# EAGLE design ALU (EAGLE 5.12)

## Sheet 1 of 5
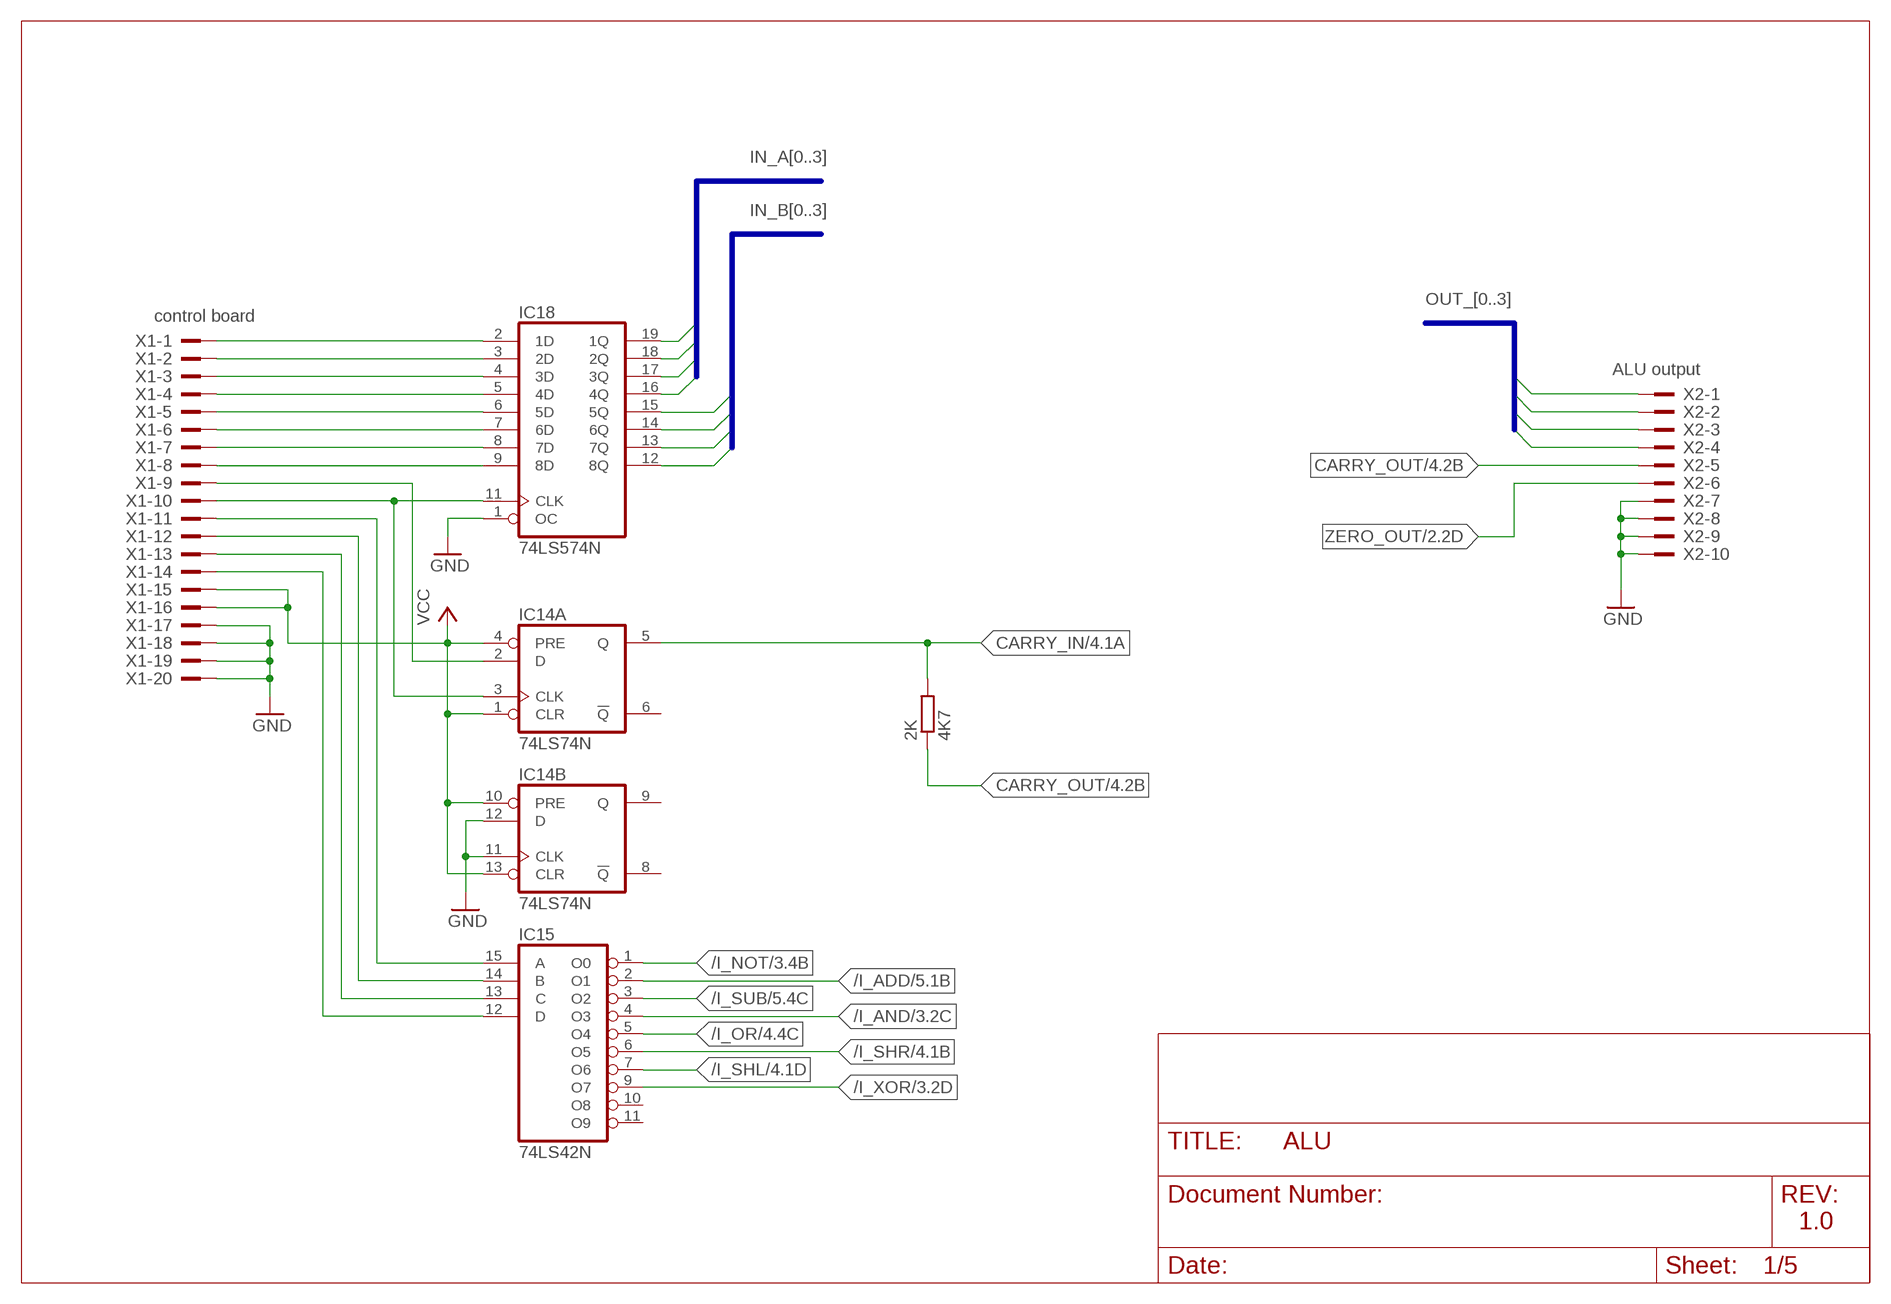
[diagram p0: schematic, sheet 1]

### Parts
2K  4K7  R-EU_0207/12  [0207/12]
IC14  74LS74N  74S74N  [DIL14]
IC15  74LS42N  [DIL16]
IC18  74LS574N  74AS574N  [DIL20]
X1  control board  2520-  [PAK100/2500-20]
X2  ALU output  2510-  [PAK100/2500-10]

### Nets
/I_ADD: IC15.2(O1) ; also sheet 5
/I_AND: IC15.4(O3) ; also sheet 3
/I_NOT: IC15.1(O0) ; also sheet 3
/I_OR: IC15.5(O4) ; also sheet 4
/I_SHL: IC15.7(O6) ; also sheet 4
/I_SHR: IC15.6(O5) ; also sheet 4
/I_SUB: IC15.3(O2) ; also sheet 5
/I_XOR: IC15.9(O7) ; also sheet 3
A0: IC18.2(1D) X1.1
A1: IC18.3(2D) X1.2
A2: IC18.4(3D) X1.3
A3: IC18.5(4D) X1.4
B0: IC18.6(5D) X1.5
B1: IC18.7(6D) X1.6
B2: IC18.8(7D) X1.7
B3: IC18.9(8D) X1.8
CARRY: IC14.2(A:D) X1.9
CARRY_IN: 2K.2 IC14.5(A:Q) ; also sheet 4,5
CARRY_OUT: 2K.1 X2.5 ; also sheet 4,5
FUNC0: IC15.15(A) X1.11
FUNC1: IC15.14(B) X1.12
FUNC2: IC15.13(C) X1.13
FUNC3: IC15.12(D) X1.14
GND: IC14.11(B:CLK) IC14.12(B:D) IC18.1(OC) X1.17 X1.18 X1.19 X1.20 X2.7 X2.8 X2.9 X2.10 ; also sheet 2,3,4,5
IN_A0: IC18.19(1Q) ; also sheet 2,3,4,5
IN_A1: IC18.18(2Q) ; also sheet 2,3,4,5
IN_A2: IC18.17(3Q) ; also sheet 2,3,4,5
IN_A3: IC18.16(4Q) ; also sheet 2,3,4,5
IN_B0: IC18.15(5Q) ; also sheet 2,3,4,5
IN_B1: IC18.14(6Q) ; also sheet 2,3,4,5
IN_B2: IC18.13(7Q) ; also sheet 2,3,4,5
IN_B3: IC18.12(8Q) ; also sheet 2,3,4,5
LOAD_DATA: IC14.3(A:CLK) IC18.11(CLK) X1.10
OUT_0: X2.1 ; also sheet 2,3,4,5
OUT_1: X2.2 ; also sheet 2,3,4,5
OUT_2: X2.3 ; also sheet 2,3,4,5
OUT_3: X2.4 ; also sheet 2,3,4,5
VCC: IC14.1(A:CLR) IC14.4(A:PRE) IC14.10(B:PRE) IC14.13(B:CLR) X1.15 X1.16 ; also sheet 2
ZERO_OUT: X2.6 ; also sheet 2
Unconnected: IC14.6(A:!Q) IC14.8(B:!Q) IC14.9(B:Q) IC15.10(O8) IC15.11(O9)

### Buses
IN_A[0..3]
IN_B[0..3]
OUT_[0..3]

### Notes on the sheet
- 1.0

## Sheet 2 of 5
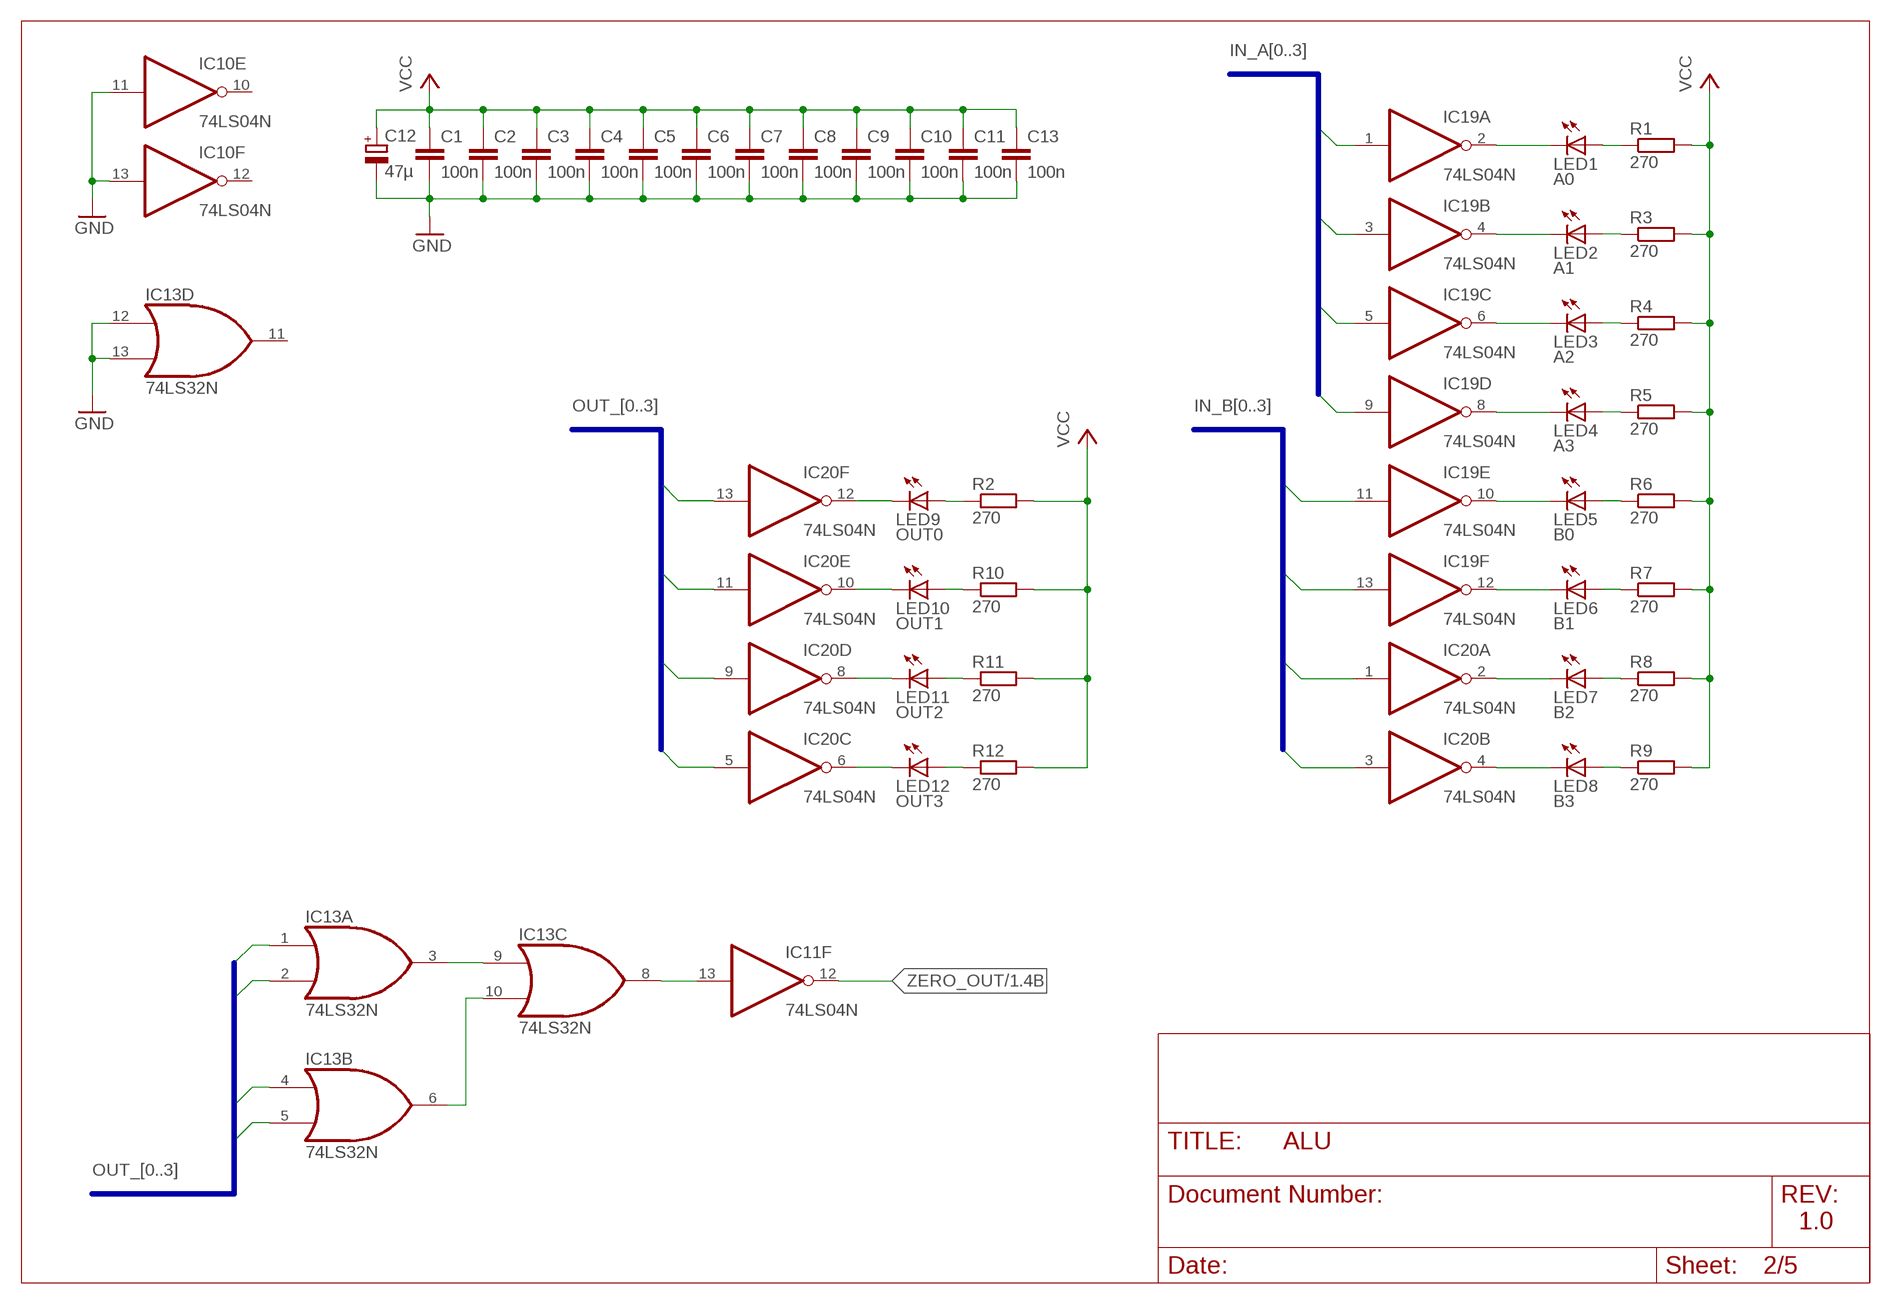
[diagram p1: schematic, sheet 2]

### Parts
C1  100n  C-EU050-025X075  [C050-025X075]
C2  100n  C-EU050-025X075  [C050-025X075]
C3  100n  C-EU050-025X075  [C050-025X075]
C4  100n  C-EU050-025X075  [C050-025X075]
C5  100n  C-EU050-025X075  [C050-025X075]
C6  100n  C-EU050-025X075  [C050-025X075]
C7  100n  C-EU050-025X075  [C050-025X075]
C8  100n  C-EU050-025X075  [C050-025X075]
C9  100n  C-EU050-025X075  [C050-025X075]
C10  100n  C-EU050-025X075  [C050-025X075]
C11  100n  C-EU050-025X075  [C050-025X075]
C12  47µ  CPOL-EUE2.5-6  [E2,5-6]
C13  100n  C-EU050-025X075  [C050-025X075]
IC10  74LS04N  [DIL14]
IC11  74LS04N  [DIL14]
IC13  74LS32N  [DIL14]
IC19  74LS04N  [DIL14]
IC20  74LS04N  [DIL14]
LED1  A0  LED5MM  [LED5MM]
LED2  A1  LED5MM  [LED5MM]
LED3  A2  LED5MM  [LED5MM]
LED4  A3  LED5MM  [LED5MM]
LED5  B0  LED5MM  [LED5MM]
LED6  B1  LED5MM  [LED5MM]
LED7  B2  LED5MM  [LED5MM]
LED8  B3  LED5MM  [LED5MM]
LED9  OUT0  LED5MM  [LED5MM]
LED10  OUT1  LED5MM  [LED5MM]
LED11  OUT2  LED5MM  [LED5MM]
LED12  OUT3  LED5MM  [LED5MM]
R1  270  R-EU_0207/2V  [0207/2V]
R2  270  R-EU_0207/2V  [0207/2V]
R3  270  R-EU_0207/2V  [0207/2V]
R4  270  R-EU_0207/2V  [0207/2V]
R5  270  R-EU_0207/2V  [0207/2V]
R6  270  R-EU_0207/2V  [0207/2V]
R7  270  R-EU_0207/2V  [0207/2V]
R8  270  R-EU_0207/2V  [0207/2V]
R9  270  R-EU_0207/2V  [0207/2V]
R10  270  R-EU_0207/2V  [0207/2V]
R11  270  R-EU_0207/2V  [0207/2V]
R12  270  R-EU_0207/2V  [0207/2V]

### Nets
GND: C1.2 C2.2 C3.2 C4.2 C5.2 C6.2 C7.2 C8.2 C9.2 C10.2 C11.2 C12.- C13.2 IC10.11(E:I) IC10.13(F:I) IC13.12(D:I0) IC13.13(D:I1) ; also sheet 1,3,4,5
IN_A0: IC19.1(A:I) ; also sheet 1,3,4,5
IN_A1: IC19.3(B:I) ; also sheet 1,3,4,5
IN_A2: IC19.5(C:I) ; also sheet 1,3,4,5
IN_A3: IC19.9(D:I) ; also sheet 1,3,4,5
IN_B0: IC19.11(E:I) ; also sheet 1,3,4,5
IN_B1: IC19.13(F:I) ; also sheet 1,3,4,5
IN_B2: IC20.1(A:I) ; also sheet 1,3,4,5
IN_B3: IC20.3(B:I) ; also sheet 1,3,4,5
N$9: IC19.2(A:O) LED1.K(C)
N$12: IC13.3(A:O) IC13.9(C:I0)
N$23: IC19.4(B:O) LED2.K(C)
N$24: IC19.6(C:O) LED3.K(C)
N$25: IC13.6(B:O) IC13.10(C:I1)
N$26: IC11.13(F:I) IC13.8(C:O)
N$27: IC19.8(D:O) LED4.K(C)
N$28: IC19.10(E:O) LED5.K(C)
N$37: IC19.12(F:O) LED6.K(C)
N$38: IC20.2(A:O) LED7.K(C)
N$39: IC20.4(B:O) LED8.K(C)
N$40: LED1.A R1.1
N$41: LED2.A R3.1
N$43: LED3.A R4.1
N$44: LED4.A R5.1
N$45: LED5.A R6.1
N$46: LED6.A R7.1
N$47: LED7.A R8.1
N$48: LED8.A R9.1
N$49: IC20.12(F:O) LED9.K(C)
N$50: IC20.10(E:O) LED10.K(C)
N$51: IC20.8(D:O) LED11.K(C)
N$52: IC20.6(C:O) LED12.K(C)
N$53: LED9.A R2.1
N$54: LED10.A R10.1
N$55: LED11.A R11.1
N$56: LED12.A R12.1
OUT_0: IC13.1(A:I0) IC20.13(F:I) ; also sheet 1,3,4,5
OUT_1: IC13.2(A:I1) IC20.11(E:I) ; also sheet 1,3,4,5
OUT_2: IC13.4(B:I0) IC20.9(D:I) ; also sheet 1,3,4,5
OUT_3: IC13.5(B:I1) IC20.5(C:I) ; also sheet 1,3,4,5
VCC: C1.1 C2.1 C3.1 C4.1 C5.1 C6.1 C7.1 C8.1 C9.1 C10.1 C11.1 C12.+ C13.1 R1.2 R2.2 R3.2 R4.2 R5.2 R6.2 R7.2 R8.2 R9.2 R10.2 R11.2 R12.2 ; also sheet 1
ZERO_OUT: IC11.12(F:O) ; also sheet 1
Unconnected: IC10.10(E:O) IC10.12(F:O) IC13.11(D:O)

### Buses
IN_A[0..3]
IN_B[0..3]
OUT_[0..3]

### Notes on the sheet
- 1.0

## Sheet 3 of 5
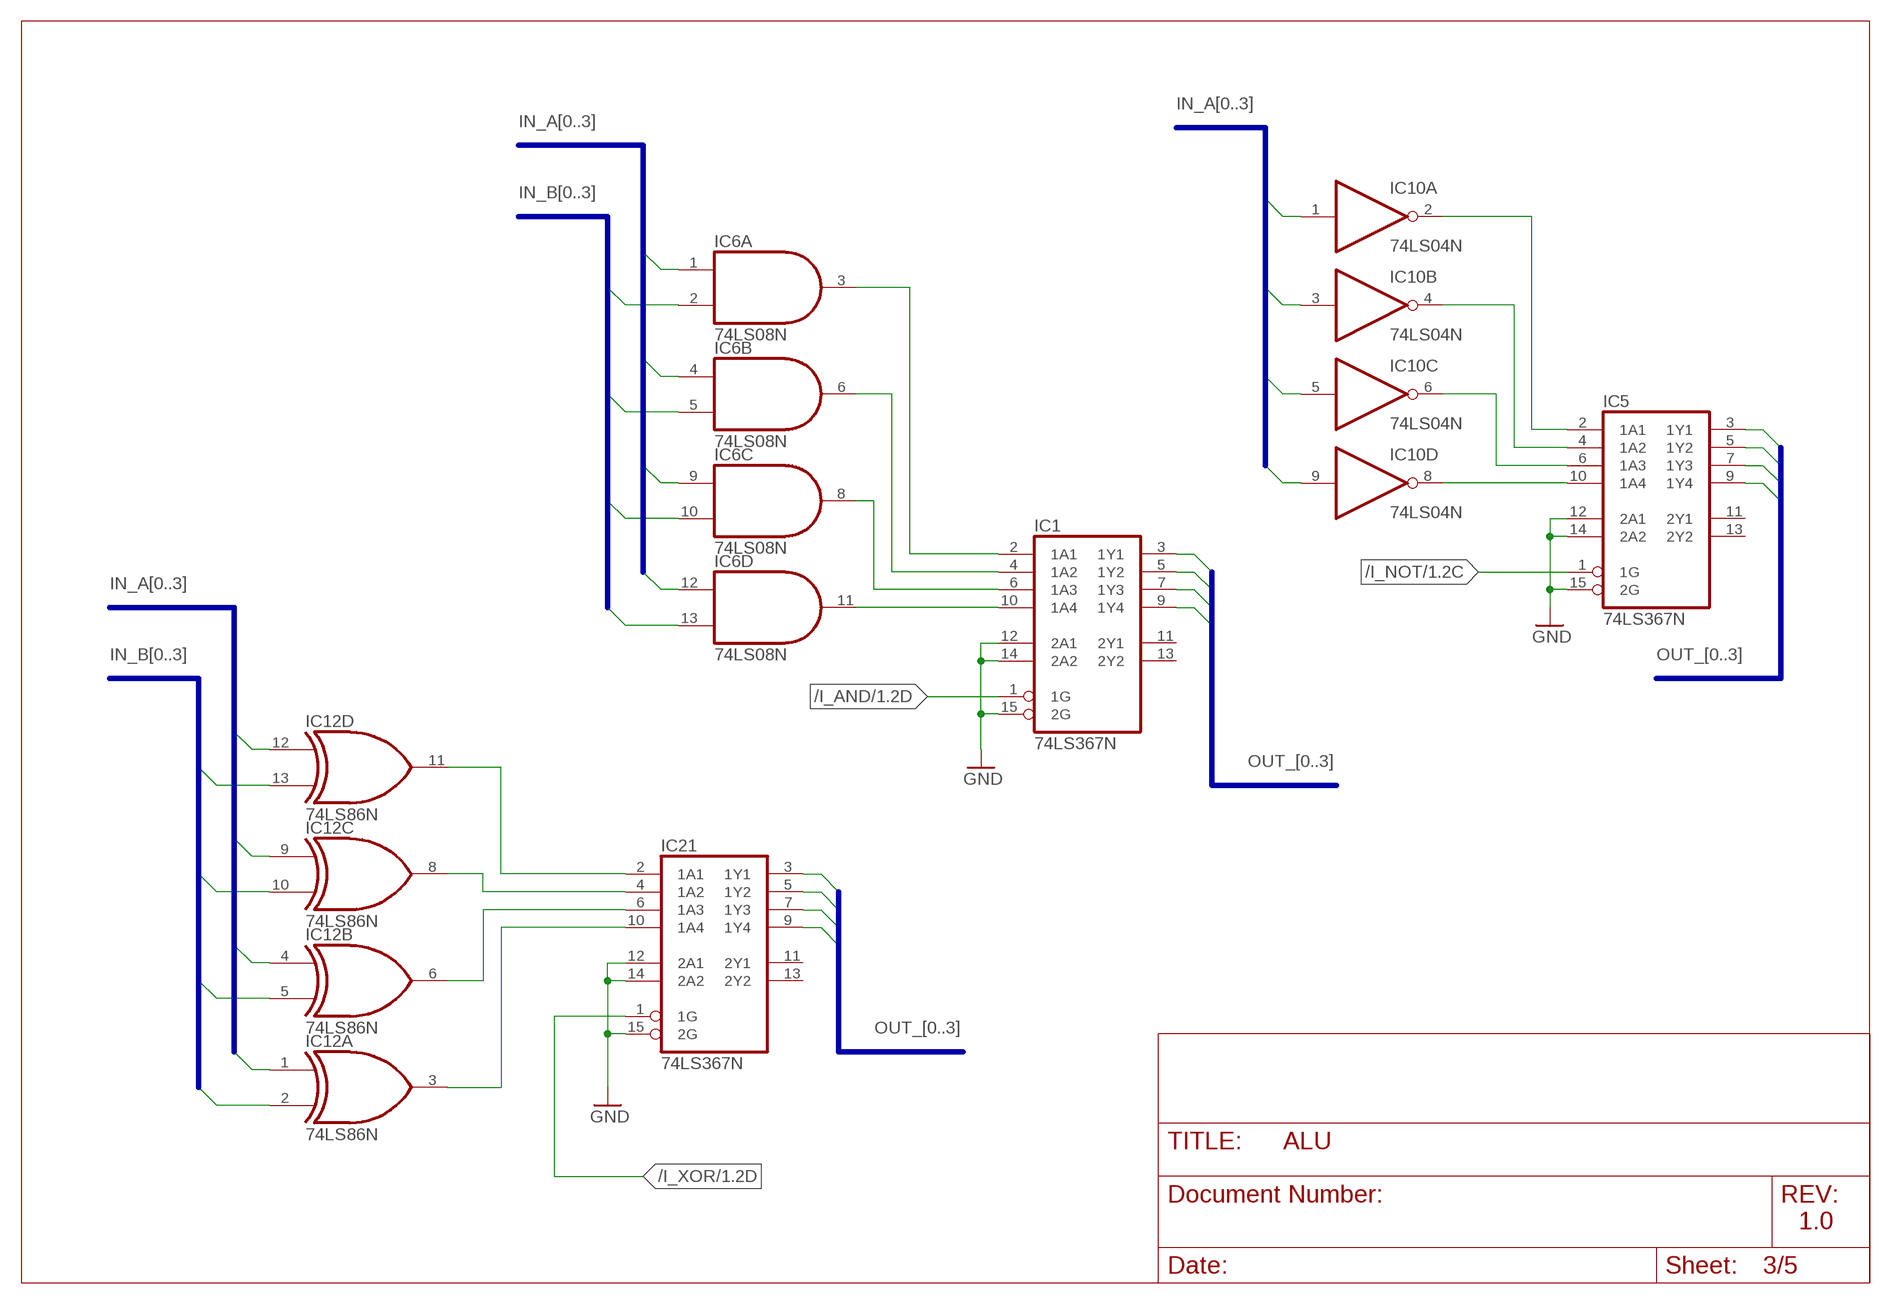
[diagram p2: schematic, sheet 3]

### Parts
IC1  74LS367N  74367N  [DIL16]
IC5  74LS367N  74367N  [DIL16]
IC6  74LS08N  [DIL14]
IC12  74LS86N  [DIL14]
IC21  74LS367N  74367N  [DIL16]

### Nets
/I_AND: IC1.1(1G) ; also sheet 1
/I_NOT: IC5.1(1G) ; also sheet 1
/I_XOR: IC21.1(1G) ; also sheet 1
GND: IC1.12(2A1) IC1.14(2A2) IC1.15(2G) IC5.12(2A1) IC5.14(2A2) IC5.15(2G) IC21.12(2A1) IC21.14(2A2) IC21.15(2G) ; also sheet 1,2,4,5
IN_A0: IC6.1(A:I0) IC10.1(A:I) IC12.12(D:I0) ; also sheet 1,2,4,5
IN_A1: IC6.4(B:I0) IC10.3(B:I) IC12.9(C:I0) ; also sheet 1,2,4,5
IN_A2: IC6.9(C:I0) IC10.5(C:I) IC12.4(B:I0) ; also sheet 1,2,4,5
IN_A3: IC6.12(D:I0) IC10.9(D:I) IC12.1(A:I0) ; also sheet 1,2,4,5
IN_B0: IC6.2(A:I1) IC12.13(D:I1) ; also sheet 1,2,4,5
IN_B1: IC6.5(B:I1) IC12.10(C:I1) ; also sheet 1,2,4,5
IN_B2: IC6.10(C:I1) IC12.5(B:I1) ; also sheet 1,2,4,5
IN_B3: IC6.13(D:I1) IC12.2(A:I1) ; also sheet 1,2,4,5
N$1: IC1.2(1A1) IC6.3(A:O)
N$2: IC1.4(1A2) IC6.6(B:O)
N$3: IC1.6(1A3) IC6.8(C:O)
N$4: IC1.10(1A4) IC6.11(D:O)
N$33: IC5.2(1A1) IC10.2(A:O)
N$34: IC5.4(1A2) IC10.4(B:O)
N$35: IC5.6(1A3) IC10.6(C:O)
N$36: IC5.10(1A4) IC10.8(D:O)
N$63: IC12.11(D:O) IC21.2(1A1)
N$64: IC12.8(C:O) IC21.4(1A2)
N$65: IC12.6(B:O) IC21.6(1A3)
N$66: IC12.3(A:O) IC21.10(1A4)
OUT_0: IC1.3(1Y1) IC5.3(1Y1) IC21.3(1Y1) ; also sheet 1,2,4,5
OUT_1: IC1.5(1Y2) IC5.5(1Y2) IC21.5(1Y2) ; also sheet 1,2,4,5
OUT_2: IC1.7(1Y3) IC5.7(1Y3) IC21.7(1Y3) ; also sheet 1,2,4,5
OUT_3: IC1.9(1Y4) IC5.9(1Y4) IC21.9(1Y4) ; also sheet 1,2,4,5
Unconnected: IC1.11(2Y1) IC1.13(2Y2) IC5.11(2Y1) IC5.13(2Y2) IC21.11(2Y1) IC21.13(2Y2)

### Buses
OUT_[0..3]
IN_A[0..3]
IN_B[0..3]

### Notes on the sheet
- 1.0

## Sheet 4 of 5
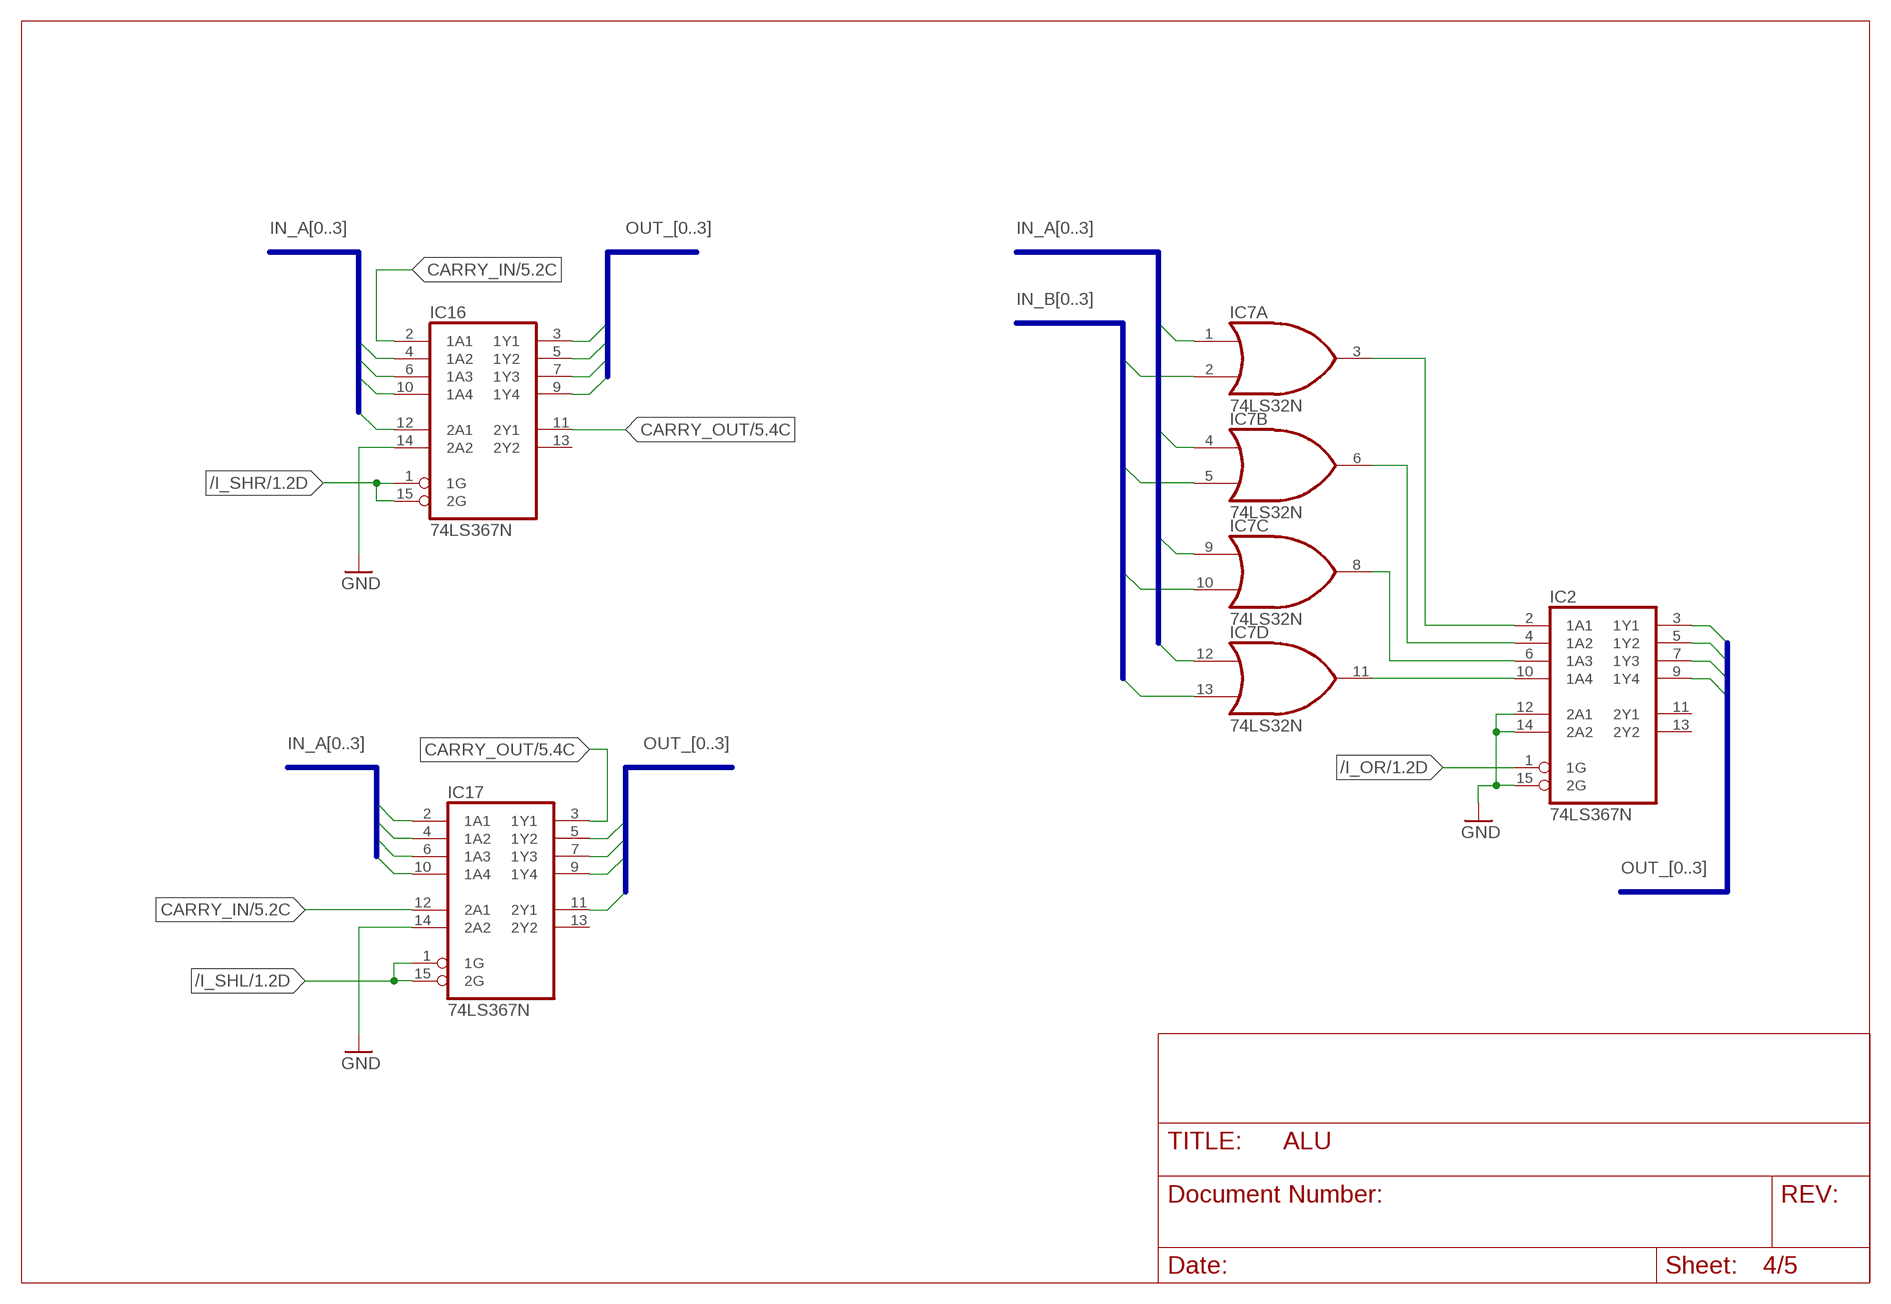
[diagram p3: schematic, sheet 4]

### Parts
IC2  74LS367N  74367N  [DIL16]
IC7  74LS32N  [DIL14]
IC16  74LS367N  74367N  [DIL16]
IC17  74LS367N  74367N  [DIL16]

### Nets
/I_OR: IC2.1(1G) ; also sheet 1
/I_SHL: IC17.1(1G) IC17.15(2G) ; also sheet 1
/I_SHR: IC16.1(1G) IC16.15(2G) ; also sheet 1
CARRY_IN: IC16.2(1A1) IC17.12(2A1) ; also sheet 1,5
CARRY_OUT: IC16.11(2Y1) IC17.3(1Y1) ; also sheet 1,5
GND: IC2.12(2A1) IC2.14(2A2) IC2.15(2G) IC16.14(2A2) IC17.14(2A2) ; also sheet 1,2,3,5
IN_A0: IC7.1(A:I0) IC16.4(1A2) IC17.2(1A1) ; also sheet 1,2,3,5
IN_A1: IC7.4(B:I0) IC16.6(1A3) IC17.4(1A2) ; also sheet 1,2,3,5
IN_A2: IC7.9(C:I0) IC16.10(1A4) IC17.6(1A3) ; also sheet 1,2,3,5
IN_A3: IC7.12(D:I0) IC16.12(2A1) IC17.10(1A4) ; also sheet 1,2,3,5
IN_B0: IC7.2(A:I1) ; also sheet 1,2,3,5
IN_B1: IC7.5(B:I1) ; also sheet 1,2,3,5
IN_B2: IC7.10(C:I1) ; also sheet 1,2,3,5
IN_B3: IC7.13(D:I1) ; also sheet 1,2,3,5
N$5: IC2.10(1A4) IC7.11(D:O)
N$6: IC2.6(1A3) IC7.8(C:O)
N$7: IC2.4(1A2) IC7.6(B:O)
N$8: IC2.2(1A1) IC7.3(A:O)
OUT_0: IC2.3(1Y1) IC16.3(1Y1) IC17.5(1Y2) ; also sheet 1,2,3,5
OUT_1: IC2.5(1Y2) IC16.5(1Y2) IC17.7(1Y3) ; also sheet 1,2,3,5
OUT_2: IC2.7(1Y3) IC16.7(1Y3) IC17.9(1Y4) ; also sheet 1,2,3,5
OUT_3: IC2.9(1Y4) IC16.9(1Y4) IC17.11(2Y1) ; also sheet 1,2,3,5
Unconnected: IC2.11(2Y1) IC2.13(2Y2) IC16.13(2Y2) IC17.13(2Y2)

### Buses
OUT_[0..3]
IN_A[0..3]
IN_B[0..3]

## Sheet 5 of 5
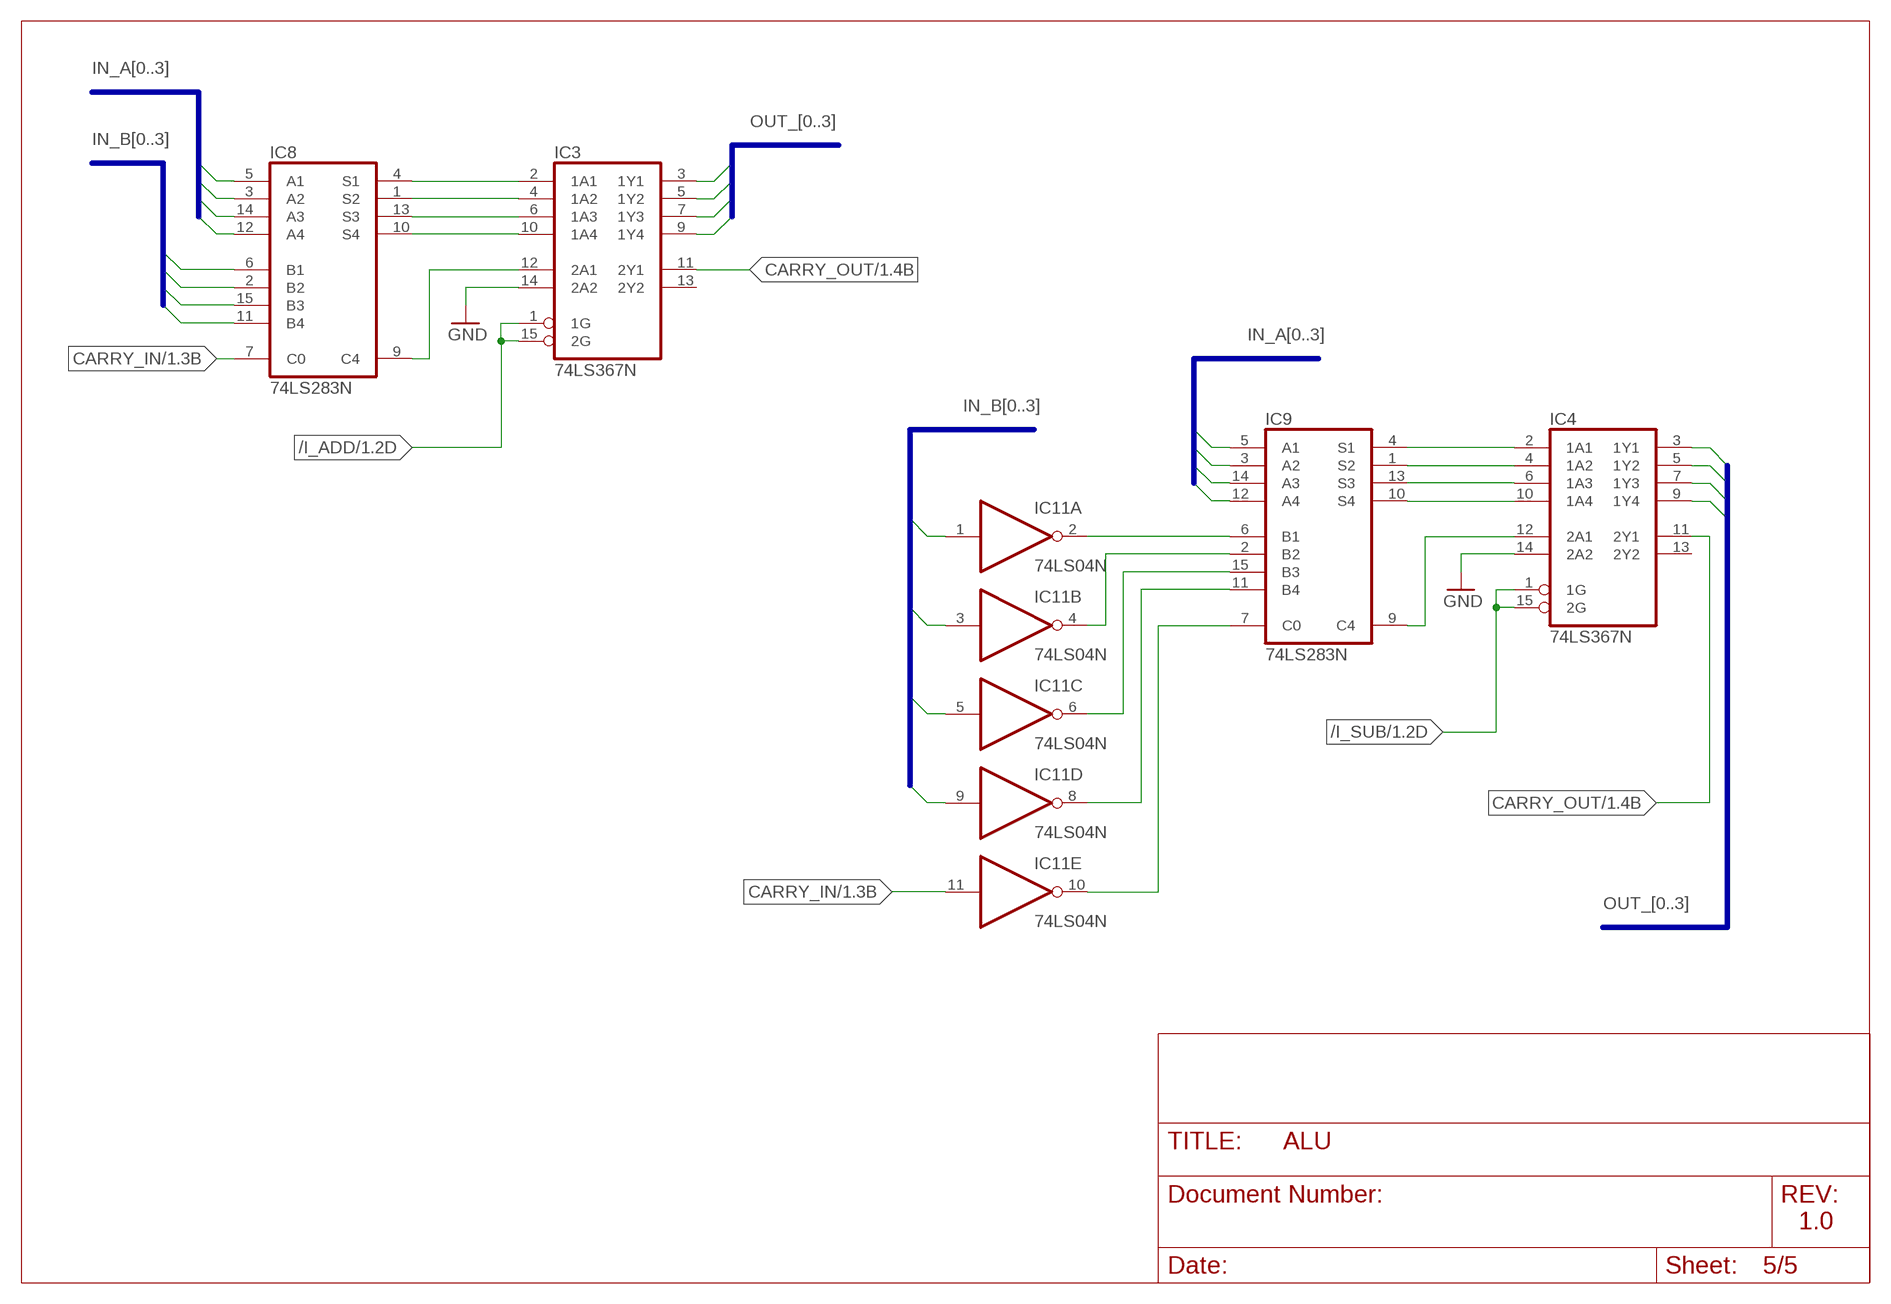
[diagram p4: schematic, sheet 5]

### Parts
IC3  74LS367N  74367N  [DIL16]
IC4  74LS367N  74367N  [DIL16]
IC8  74LS283N  74S283N  [DIL16]
IC9  74LS283N  74S283N  [DIL16]

### Nets
/I_ADD: IC3.1(1G) IC3.15(2G) ; also sheet 1
/I_SUB: IC4.1(1G) IC4.15(2G) ; also sheet 1
CARRY_IN: IC8.7(C0) IC11.11(E:I) ; also sheet 1,4
CARRY_OUT: IC3.11(2Y1) IC4.11(2Y1) ; also sheet 1,4
GND: IC3.14(2A2) IC4.14(2A2) ; also sheet 1,2,3,4
IN_A0: IC8.5(A1) IC9.5(A1) ; also sheet 1,2,3,4
IN_A1: IC8.3(A2) IC9.3(A2) ; also sheet 1,2,3,4
IN_A2: IC8.14(A3) IC9.14(A3) ; also sheet 1,2,3,4
IN_A3: IC8.12(A4) IC9.12(A4) ; also sheet 1,2,3,4
IN_B0: IC8.6(B1) IC11.1(A:I) ; also sheet 1,2,3,4
IN_B1: IC8.2(B2) IC11.3(B:I) ; also sheet 1,2,3,4
IN_B2: IC8.15(B3) IC11.5(C:I) ; also sheet 1,2,3,4
IN_B3: IC8.11(B4) IC11.9(D:I) ; also sheet 1,2,3,4
N$11: IC9.7(C0) IC11.10(E:O)
N$13: IC3.2(1A1) IC8.4(S1)
N$14: IC3.4(1A2) IC8.1(S2)
N$15: IC3.6(1A3) IC8.13(S3)
N$16: IC3.10(1A4) IC8.10(S4)
N$17: IC4.2(1A1) IC9.4(S1)
N$18: IC4.4(1A2) IC9.1(S2)
N$19: IC4.6(1A3) IC9.13(S3)
N$20: IC4.10(1A4) IC9.10(S4)
N$21: IC4.12(2A1) IC9.9(C4)
N$22: IC3.12(2A1) IC8.9(C4)
N$29: IC9.6(B1) IC11.2(A:O)
N$30: IC9.2(B2) IC11.4(B:O)
N$31: IC9.15(B3) IC11.6(C:O)
N$32: IC9.11(B4) IC11.8(D:O)
OUT_0: IC3.3(1Y1) IC4.3(1Y1) ; also sheet 1,2,3,4
OUT_1: IC3.5(1Y2) IC4.5(1Y2) ; also sheet 1,2,3,4
OUT_2: IC3.7(1Y3) IC4.7(1Y3) ; also sheet 1,2,3,4
OUT_3: IC3.9(1Y4) IC4.9(1Y4) ; also sheet 1,2,3,4
Unconnected: IC3.13(2Y2) IC4.13(2Y2)

### Buses
OUT_[0..3]
IN_A[0..3]
IN_B[0..3]

### Notes on the sheet
- 1.0

## Power pins joined to a net without a drawn wire
GND: IC1.8(GND) IC2.8(GND) IC3.8(GND) IC4.8(GND) IC5.8(GND) IC6.7(P:GND) IC7.7(P:GND) IC8.8(GND) IC9.8(GND) IC10.7(P:GND) IC11.7(P:GND) IC12.7(P:GND) IC13.7(P:GND) IC14.7(P:GND) IC15.8(GND) IC16.8(GND) IC17.8(GND) IC18.10(GND) IC19.7(P:GND) IC20.7(P:GND) IC21.8(GND)
VCC: IC1.16(VCC) IC2.16(VCC) IC3.16(VCC) IC4.16(VCC) IC5.16(VCC) IC6.14(P:VCC) IC7.14(P:VCC) IC8.16(VCC) IC9.16(VCC) IC10.14(P:VCC) IC11.14(P:VCC) IC12.14(P:VCC) IC13.14(P:VCC) IC14.14(P:VCC) IC15.16(VCC) IC16.16(VCC) IC17.16(VCC) IC18.20(VCC) IC19.14(P:VCC) IC20.14(P:VCC) IC21.16(VCC)

## Library data of the parts
2K R1-R12 = rcl:R-EU_: RESISTOR, European symbol
C1-C11 C13 = rcl:C-EU: CAPACITOR, European symbol
C12 = rcl:CPOL-EU: POLARIZED CAPACITOR, European symbol
IC1-IC5 IC16 IC17 IC21 = 74xx-us:74*367: Hex BUS DRIVER, 3-state
IC6 = 74xx-us:74*08: Quad 2-input AND gate
IC7 IC13 = 74xx-us:74*32: Quad 2-input OR gate
IC8 IC9 = 74xx-us:74*283: 4-bit binary FULL ADDER, fast carry
IC10 IC11 IC19 IC20 = 74xx-us:74*04: Hex INVERTER
IC12 = 74xx-us:74*86: Quad 2-input EXCLUSIV-OR (XOR) gate
IC14 = 74xx-us:74*74: Dual D type positive edge triggered FLIP FLOP, preset and clear
IC15 = 74xx-us:74*42: 4-line to 10-line DECODER (1-of-10)
IC18 = 74xx-us:74*574: 8-bit D type FLIP FLOP bus driver
LED1-LED12 = led:LED: LED OSRAM: - CHIPLED LG R971, LG N971, LY N971, LG Q971, LY Q971, LO R971, LY R971 LH N974, LH R974 LS Q976, LO Q976, LY Q976 LO Q996 - Hyper CHIPLED LW Q18S LB Q993, LB Q99A, LB R99A - SideLED LS A670, LO A670, LY A670, LG A670, LP A670 LB A673, LV A673, LT A673, LW A673 LH A674 LY A675 LS A676, LA A676, LO A676, LY A676, LW A676 LS A679, LY A679, LG A679 - Hyper Micro SIDELED® LS Y876, LA Y876, LO Y876, LY Y876 LT Y87S - SmartLED LW L88C, LW L88S LB L89C, LB L89S, LG L890 LS L89K, LO L89K, LY L89K LS L896, LA L896, LO L896, LY L896 - TOPLED LS T670, LO T670, LY T670, LG T670, LP T670 LSG T670, LSP T670, LSY T670, LOP T670, LYG T670 LG T671, LOG T671, LSG T671 LB T673, LV T673, LT T673, LW T673 LH T674 LS T676, LA T676, LO T676, LY T676, LB T676, LH T676, LSB T676, LW T676 LB T67C, LV T67C, LT T67C, LS T67K, LO T67K, LY T67K, LW E67C LS E67B, LA E67B, LO E67B, LY E67B, LB E67C, LV E67C, LT E67C LW T67C LS T679, LY T679, LG T679 LS T770, LO T770, LY T770, LG T770, LP T770 LB T773, LV T773, LT T773, LW T773 LH T774 LS E675, LA E675, LY E675, LS T675 LS T776, LA T776, LO T776, LY T776, LB T776 LHGB T686 LT T68C, LB T68C - Hyper Mini TOPLED® LB M676 - Mini TOPLED Santana® LG M470 LS M47K, LO M47K, LY M47K Source: http://www.osram.convergy.de LUXEON: - LUMILED® LXK2-PW12-R00, LXK2-PW12-S00, LXK2-PW14-U00, LXK2-PW14-V00 LXK2-PM12-R00, LXK2-PM12-S00, LXK2-PM14-U00 LXK2-PE12-Q00, LXK2-PE12-R00, LXK2-PE12-S00, LXK2-PE14-T00, LXK2-PE14-U00 LXK2-PB12-K00, LXK2-PB12-L00, LXK2-PB12-M00, LXK2-PB14-N00, LXK2-PB14-P00, LXK2-PB14-Q00 LXK2-PR12-L00, LXK2-PR12-M00, LXK2-PR14-Q00, LXK2-PR14-R00 LXK2-PD12-Q00, LXK2-PD12-R00, LXK2-PD12-S00 LXK2-PH12-R00, LXK2-PH12-S00 LXK2-PL12-P00, LXK2-PL12-Q00, LXK2-PL12-R00 Source: www.luxeon.com KINGBRIGHT: KA-3528ASYC Source: www.kingbright.com
X1 = con-3m:2520-: 3M (TM) Pak 100 4-Wall Header Source: 3M; OC_FARNELL: unknown; OC_NEWARK: unknown
X2 = con-3m:2510-: 3M (TM) Pak 100 4-Wall Header Source: 3M; MF: 3M; MPN: 2510-6002UB; OC_FARNELL: 9838244; OC_NEWARK: 46F4725

## Board
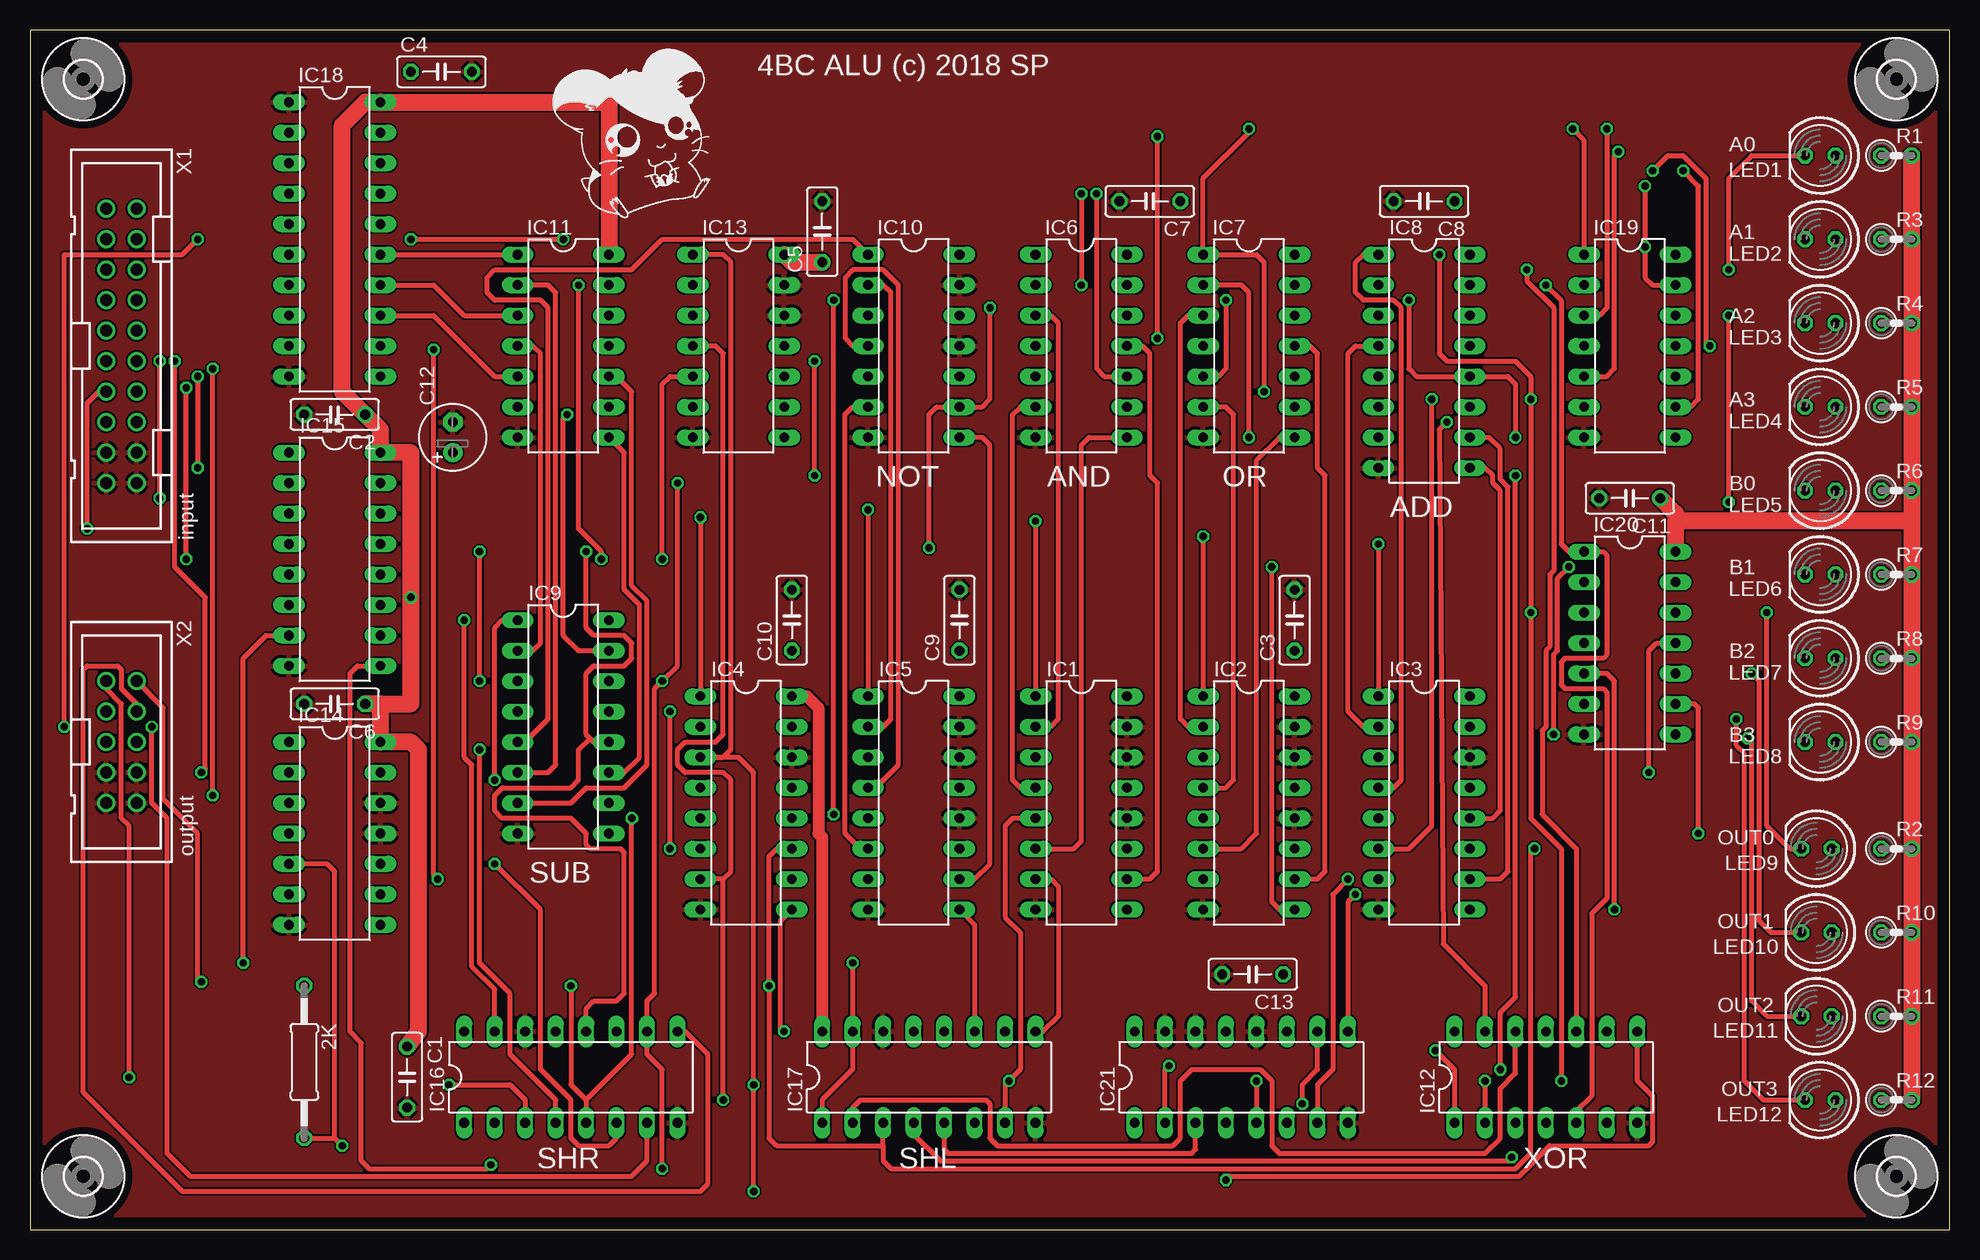
[diagram p5: board, top side]
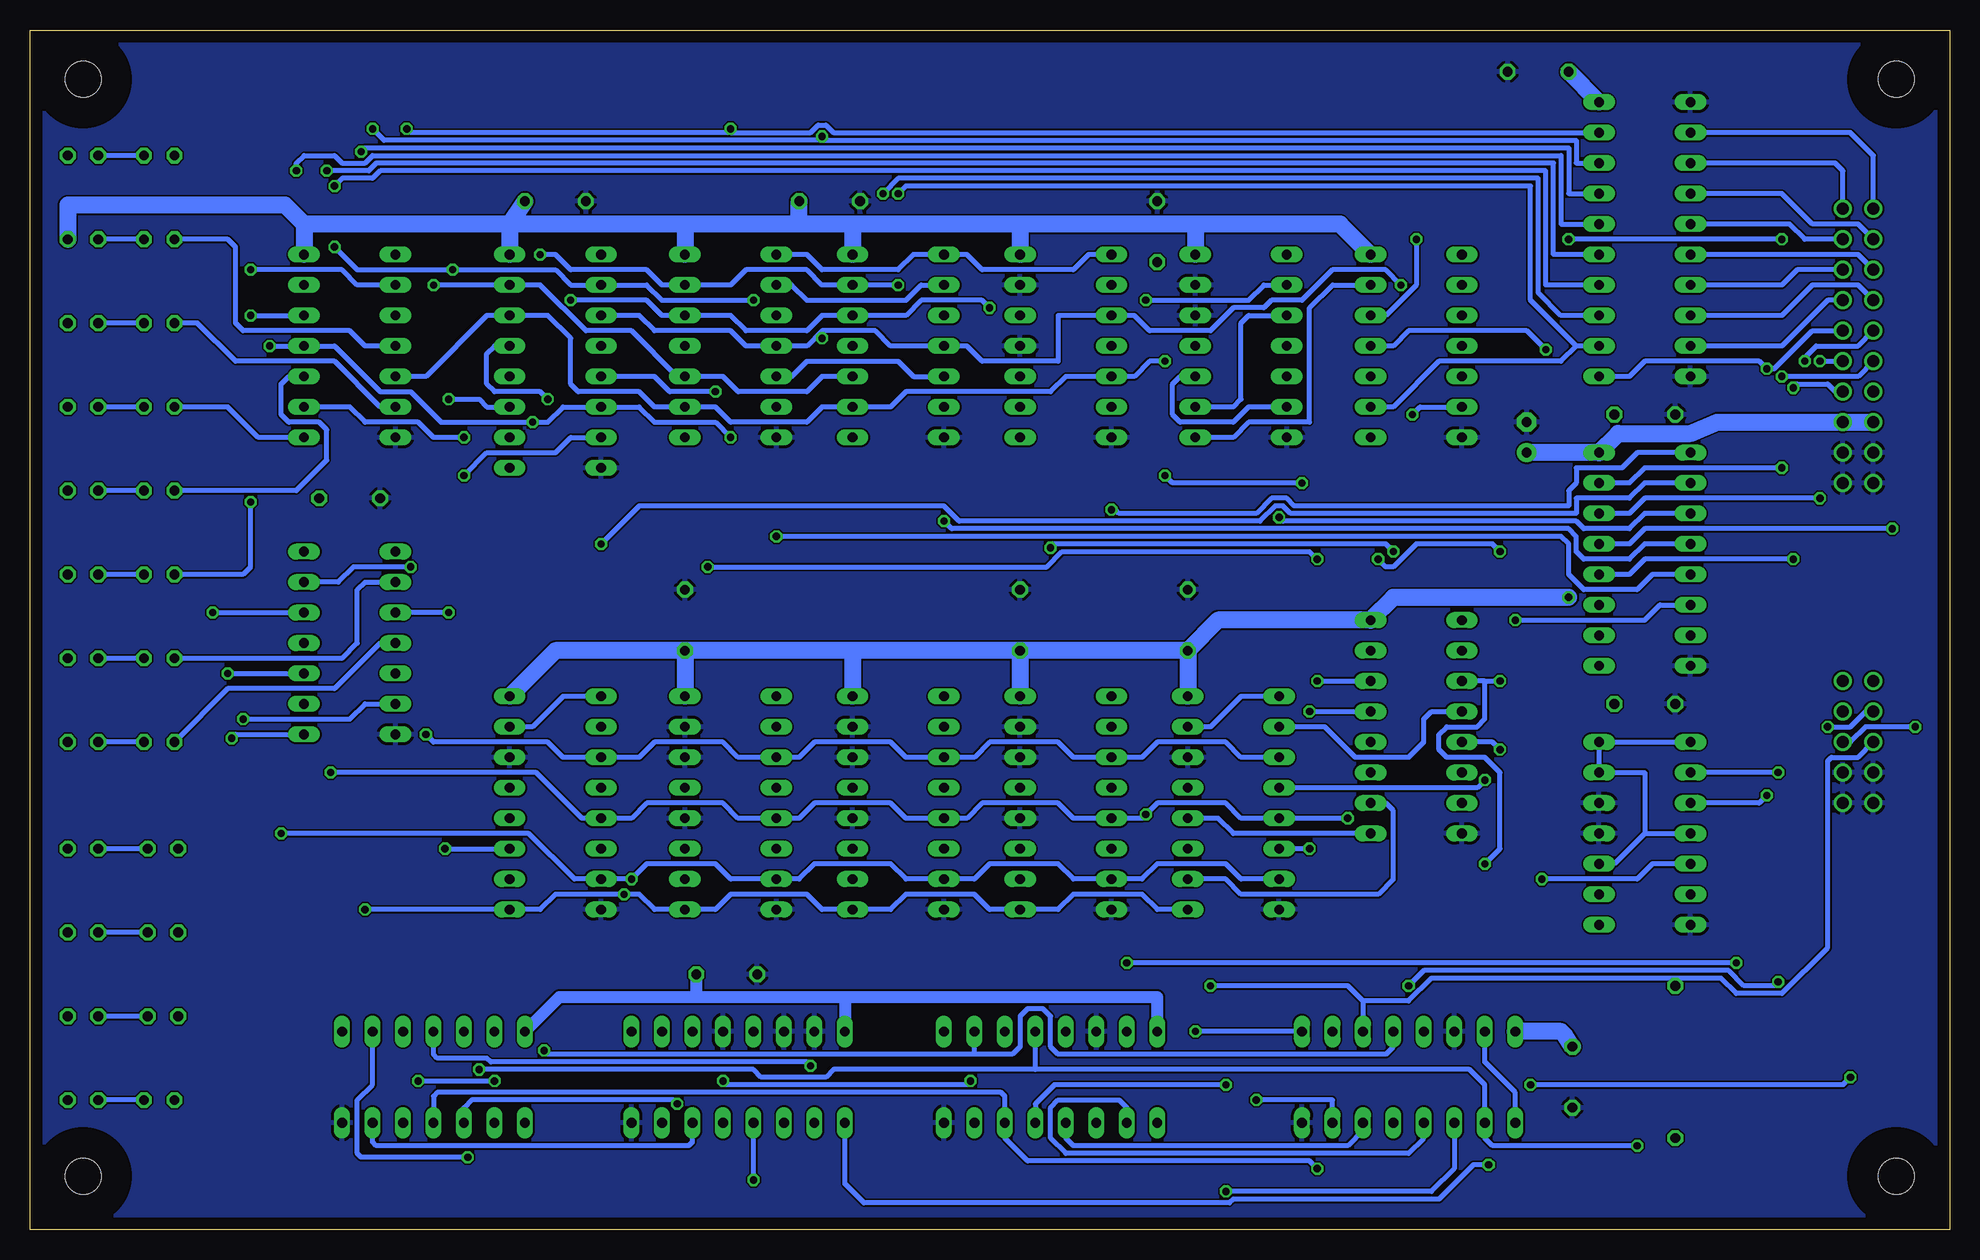
[diagram p6: board, bottom side, seen from below]

Size 160 x 100 mm. Coordinates in mm from the lower left corner, seen from the top.
Outline: 0,0 160,0 160,100 0,100 0,0
Copper layers (1*16): Top 0.035mm / dielectric 1.5mm / Bottom 0.035mm
Design rules "default *": minimum track width 10mil, minimum drill 16mil, track to track 6mil, track to pad 6mil, pad to pad 6mil, via to via 6mil, smd to smd 6mil, copper to edge 40mil, drill to drill 8mil, minimum pad ring 10mil, minimum via ring 8mil, stop-mask expansion 4mil, vias tented up to drill 0mil, thermal gap 10mil

### Footprints (pad centres in the part's own frame; a part is rotated, then mirrored left to right if it is on the bottom)
0207/12 = drill 0.813 octagon: 1 -6.35,0; 2 6.35,0
C050-025X075 = drill 0.813 octagon: 1 -2.54,0; 2 2.54,0
E2,5-6 = drill 0.813 pad 1.6 round: + -1.27,0 | drill 0.813 pad 1.6 octagon: - 1.27,0
DIL16 = drill 0.813 long: 1 -8.89,-3.81; 2 -6.35,-3.81; 3 -3.81,-3.81; 4 -1.27,-3.81; 5 1.27,-3.81; 6 3.81,-3.81; 7 6.35,-3.81; 8 8.89,-3.81; 9 8.89,3.81; 10 6.35,3.81; 11 3.81,3.81; 12 1.27,3.81; 13 -1.27,3.81; 14 -3.81,3.81; 15 -6.35,3.81; 16 -8.89,3.81
DIL14 = drill 0.813 long: 1 -7.62,-3.81; 2 -5.08,-3.81; 3 -2.54,-3.81; 4 0,-3.81; 5 2.54,-3.81; 6 5.08,-3.81; 7 7.62,-3.81; 8 7.62,3.81; 9 5.08,3.81; 10 2.54,3.81; 11 0,3.81; 12 -2.54,3.81; 13 -5.08,3.81; 14 -7.62,3.81
DIL20 = drill 0.813 long: 1 -11.43,-3.81; 2 -8.89,-3.81; 3 -6.35,-3.81; 4 -3.81,-3.81; 5 -1.27,-3.81; 6 1.27,-3.81; 7 3.81,-3.81; 8 6.35,-3.81; 9 8.89,-3.81; 10 11.43,-3.81; 11 11.43,3.81; 12 8.89,3.81; 13 6.35,3.81; 14 3.81,3.81; 15 1.27,3.81; 16 -1.27,3.81; 17 -3.81,3.81; 18 -6.35,3.81; 19 -8.89,3.81; 20 -11.43,3.81
LED5MM = drill 0.813 octagon: A -1.27,0; K 1.27,0
0207/2V = drill 0.813 octagon: 1 -1.27,0; 2 1.27,0
3,0 = hole 3: 0,0
PAK100/2500-20 = drill 1 pad 1.422 round: 1 -11.43,-1.27; 2 -11.43,1.27; 3 -8.89,-1.27; 4 -8.89,1.27; 5 -6.35,-1.27; 6 -6.35,1.27; 7 -3.81,-1.27; 8 -3.81,1.27; 9 -1.27,-1.27; 10 -1.27,1.27; 11 1.27,-1.27; 12 1.27,1.27; 13 3.81,-1.27; 14 3.81,1.27; 15 6.35,-1.27; 16 6.35,1.27; 17 8.89,-1.27; 18 8.89,1.27; 19 11.43,-1.27; 20 11.43,1.27
PAK100/2500-10 = drill 1 pad 1.422 round: 1 -5.08,-1.27; 2 -5.08,1.27; 3 -2.54,-1.27; 4 -2.54,1.27; 5 0,-1.27; 6 0,1.27; 7 2.54,-1.27; 8 2.54,1.27; 9 5.08,-1.27; 10 5.08,1.27

### Placement (x,y rotation side)
2K  22.86,13.97 270 top
C1  31.43,12.7 270 top
C2  25.4,67.94 180 top
C3  105.41,50.8 90 top
C4  34.29,96.52 0 top
C5  66.04,83.19 90 top
C6  25.4,43.81 180 top
C7  93.34,85.72 180 top
C8  116.2,85.72 180 top
C9  77.47,50.8 90 top
C10  63.5,50.8 90 top
C11  133.35,60.96 180 top
C12  35.24,66.04 90 top
C13  101.92,21.27 180 top
IC1  87.63,35.56 270 top
IC2  101.6,35.56 270 top
IC3  116.2,35.56 270 top
IC4  59.69,35.56 270 top
IC5  73.66,35.56 270 top
IC6  87.63,73.66 270 top
IC7  101.6,73.66 270 top
IC8  116.2,72.39 270 top
IC9  44.45,41.91 270 top
IC10  73.66,73.66 270 top
IC11  44.45,73.66 270 top
IC12  126.36,12.7 0 top
IC13  59.05,73.66 270 top
IC14  25.4,33.02 270 top
IC15  25.4,55.88 270 top
IC16  45.09,12.7 0 top
IC17  74.93,12.7 0 top
IC18  25.4,82.55 270 top
IC19  133.35,73.66 270 top
IC20  133.35,48.9 270 top
IC21  100.97,12.7 0 top
LED1  149.22,89.53 180 top
LED2  149.22,82.55 180 top
LED3  149.22,75.56 180 top
LED4  149.22,68.58 180 top
LED5  149.22,61.59 180 top
LED6  149.22,54.61 180 top
LED7  149.22,47.62 180 top
LED8  149.22,40.64 180 top
LED9  148.91,31.75 180 top
LED10  148.91,24.77 180 top
LED11  148.91,17.78 180 top
LED12  149.22,10.79 180 top
R1  155.57,89.53 0 top
R2  155.57,31.75 0 top
R3  155.57,82.55 0 top
R4  155.57,75.56 0 top
R5  155.57,68.58 0 top
R6  155.57,61.59 0 top
R7  155.57,54.61 0 top
R8  155.57,47.62 0 top
R9  155.57,40.64 0 top
R10  155.57,24.77 0 top
R11  155.57,17.78 0 top
R12  155.57,10.79 0 top
U$1  [3,0]  4.45,95.89 0 top
U$2  [3,0]  155.57,95.89 0 top
U$3  [3,0]  155.57,4.45 0 top
U$4  [3,0]  4.45,4.45 0 top
X1  7.62,73.66 270 top
X2  7.62,40.64 270 top

### Tracks (layer width: path | path; a pad name or v marks a point on that pad's centre or on a via)
/I_ADD  (via drill 0.6)
  Top 0.406: v112.39,57.15 IC3.1
  Bottom 0.406: IC3.15 118.11,41.91 115.57,44.45 IC3.1 | v112.39,57.15 109.22,60.33 83.82,60.33 82.55,59.05 57.47,59.05 56.2,60.33 55.56,60.33 54.93,59.69 31.11,59.69 31.11,60.96 26.67,60.96 25.4,62.23 IC15.2
/I_AND  (via drill 0.6)
  Top 0.406: v83.82,59.05 IC1.1
  Bottom 0.406: v83.82,59.05 83.19,58.42 31.75,58.42 31.11,57.78 31.11,56.52 30.48,55.88 26.67,55.88 25.4,57.15 IC15.4
/I_NOT  (via drill 0.6)
  Top 0.406: v69.85,60.01 IC5.1
  Bottom 0.406: v69.85,60.01 69.53,60.01 69.22,59.69 57.78,59.69 56.52,60.96 55.24,60.96 54.61,60.33 31.75,60.33 31.75,61.59 31.11,62.23 31.11,63.5 27.3,63.5 26.04,64.77 IC15.1
/I_OR  (via drill 0.6)
  Top 0.406: v97.79,57.78 IC2.1
  Bottom 0.406: v97.79,57.78 32.38,57.78 31.75,57.15 31.75,54.61 30.48,53.34 26.04,53.34 24.77,54.61 IC15.5
/I_SHL  (via drill 0.6)
  Top 0.406: IC17.1 66.04,10.79 68.58,13.34 IC17.15 v68.58,22.23 | v17.78,22.23 17.78,47.62 19.68,49.53 IC15.7
  Bottom 0.406: v17.78,22.23 v68.58,22.23
/I_SHR  (via drill 0.6)
  Top 0.406: IC16.15 38.73,20 36.83,21.91 36.83,38.73 36.2,39.37 v36.2,50.8
  Bottom 0.406: IC16.1 36.2,11.43 38.73,13.97 IC16.15 | v36.2,50.8 25.4,50.8 24.13,52.07 IC15.6
/I_SUB  (via drill 0.6)
  Top 0.406: v55.88,59.37 IC4.1
  Bottom 0.406: IC4.15 61.59,41.91 59.05,44.45 IC4.1 | v55.88,59.37 55.56,59.05 31.11,59.05 30.48,58.42 26.67,58.42 25.4,59.69 IC15.3
/I_XOR  (via drill 0.6)
  Top 0.406: v38.42,5.4 38.1,5.08 28.26,5.08 27.62,5.71 27.62,15.56 26.67,16.51 26.67,46.35 27.3,46.99 IC15.9
  Bottom 0.406: v38.42,5.4 39.69,5.4 42.55,2.54 59.69,2.54 60.01,2.22 90.49,2.22 92.08,3.81 IC21.1
A0
  Bottom 0.406: X1.1 6.35,89.53 8.26,91.44 IC18.2
A1
  Bottom 0.406: IC18.3 9.53,88.9 8.89,88.27 X1.2
A2
  Bottom 0.406: IC18.4 13.97,86.36 11.43,83.82 7.62,83.82 X1.3
A3
  Bottom 0.406: IC18.5 13.34,83.82 12.06,82.55 X1.4
B0
  Bottom 0.406: IC18.6 7.62,81.28 X1.5
B1
  Bottom 0.406: IC18.7 13.97,78.74 12.7,80.01 X1.6
B2
  Bottom 0.406: IC18.8 13.97,76.2 11.43,78.74 7.62,78.74 X1.7
B3
  Bottom 0.406: IC18.9 13.97,73.66 10.16,77.47 X1.8
CARRY  (via drill 0.6)
  Top 0.406: v14.29,38.1 14.61,38.42 14.61,52.7 12.06,55.24 v12.06,72.39
  Bottom 0.406: v14.29,38.1 IC14.2 | X1.9 7.62,73.66 11.11,73.66 12.06,72.71 v12.06,72.39
CARRY_IN  (via drill 0.6)
  Top 0.406: v123.83,62.87 123.83,19.37 122.56,18.1 v122.56,13.34 | IC14.5 24.77,30.48 25.4,29.84 25.4,7.62 | 25.4,7.62 v26.04,6.99 | v33.97,29.21 33.66,29.53 v33.66,73.34 | 2K.2 25.4,7.62
  Bottom 0.406: IC8.7 114.94,66.04 116.2,64.77 121.92,64.77 v123.83,62.87 | 76.2,13.34 93.03,13.34 93.66,12.7 99.06,12.7 99.69,13.34 v122.56,13.34 | 76.2,13.34 IC17.12 | 76.2,13.34 40.01,13.34 38.73,12.06 IC16.2 38.73,7.62 38.1,6.99 v26.04,6.99 | IC11.11 46.35,73.66 45.09,74.93 35.24,74.93 v33.66,73.34 | v33.97,29.21 26.04,29.21 24.77,30.48 IC14.5
CARRY_OUT  (via drill 0.6)
  Top 0.406: IC4.11 62.23,31.75 61.59,31.11 v61.59,20.32 61.59,7.62 62.23,6.99 71.12,6.99 | v125.41,31.75 125.09,31.43 125.09,6.35 123.83,5.08 71.75,5.08 71.12,5.71 71.12,6.99 | 71.12,6.99 IC17.3
  Bottom 0.406: 48.9,19.05 IC16.11 | 48.9,19.05 50.16,20.32 v61.59,20.32 | v125.41,31.75 IC3.11 | 22.86,20.95 19.05,20.95 17.78,19.68 13.97,19.68 10.16,23.5 10.16,39.05 9.84,39.37 7.62,39.37 X2.5 | 22.86,20.95 43.18,20.95 45.09,19.05 48.9,19.05 | 22.86,20.95 2K.1
FUNC0  (via drill 0.6)
  Top 0.406: v13.97,71.12 v13.97,63.5
  Bottom 0.406: IC15.15 26.67,62.23 25.4,63.5 v13.97,63.5 | X1.11 7.62,71.12 v13.97,71.12
FUNC1  (via drill 0.6)
  Top 0.406: v10.79,60.96 v10.79,72.39
  Bottom 0.406: IC15.14 26.67,59.69 25.4,60.96 v10.79,60.96 | v10.79,72.39 X1.12
FUNC2  (via drill 0.6)
  Top 0.406: v4.76,58.42 4.76,68.9 5.71,69.85 X1.13
  Bottom 0.406: IC15.13 26.67,57.15 25.4,58.42 v4.76,58.42
FUNC3  (via drill 0.6)
  Top 0.406: v13.02,55.88 v13.02,70.17
  Bottom 0.406: IC15.12 26.67,54.61 25.4,55.88 v13.02,55.88 | X1.14 9.53,69.85 10.16,70.48 12.7,70.48 v13.02,70.17
GND
  pour Bottom: 0,100.33 160.02,100.33 160.02,0 0,0
  pour Top: 0,99.69 160.02,99.69 160.02,0 0,0
IN_A0  (via drill 0.6)
  Top 0.406: v102.87,69.85 102.87,80.64 102.23,81.28 IC7.1 97.79,87.63 101.6,91.44 v101.6,91.76 | v37.47,40.01 37.47,22.23 40.01,19.68 40.01,14.61 43.81,10.79 IC16.4 | IC9.5 41.27,40.64 43.18,42.55 43.18,76.83 42.55,77.47 38.73,77.47 38.1,78.11 38.1,79.38 38.73,80.01 50.16,80.01 52.7,82.55 68.58,82.55 IC10.1 | IC19.1 129.54,90.81 v128.59,91.76 | IC17.2 68.58,10.16 69.22,10.79 79.69,10.79 80.01,10.48 80.01,7.62 80.64,6.99 95.25,6.99 95.89,7.62 95.89,12.38 96.84,13.34 102.55,13.34 103.5,12.38 103.5,6.99 104.14,6.35 121.28,6.35 122.56,7.62 122.56,11.75 123.83,13.02 IC12.12
  Bottom 0.406: IC10.1 71.75,81.28 73.03,80.01 80.64,80.01 81.92,81.28 IC6.1 86.36,81.28 87.63,80.01 93.98,80.01 95.25,81.28 IC7.1 | IC8.5 107.95,71.12 106.68,69.85 v102.87,69.85 | IC16.4 43.81,7.62 45.09,6.35 73.66,6.35 74.93,7.62 74.93,10.16 74.3,10.79 69.22,10.79 68.58,10.16 IC17.2 | IC9.5 38.1,40.64 v37.47,40.01 | IC18.19 93.03,91.44 93.66,92.08 94.3,92.08 94.93,91.44 101.6,91.44 | v101.6,91.76 101.6,91.44 | 101.6,91.44 128.27,91.44 v128.59,91.76
IN_A1  (via drill 0.6)
  Top 0.406: IC16.6 48.9,7.62 48.26,6.99 45.72,6.99 45.09,7.62 45.09,10.79 42.55,13.34 42.55,26.67 v38.73,30.48 | v45.72,78.74 45.72,58.42 47.62,56.52 v47.62,55.88 | v37.47,45.72 v37.47,56.52 | v131.44,91.76 131.44,76.83 130.81,76.2 IC19.3 | v93.98,74.3 v93.98,91.12 | IC17.4 73.66,7.94 75.88,5.71 123.19,5.71 v123.51,6.03
  Bottom 0.406: IC18.18 31.11,88.9 31.11,90.81 93.98,90.81 | 93.98,74.93 89.53,74.93 88.27,73.66 IC6.4 81.92,73.66 80.64,72.39 74.3,72.39 74.3,76.2 IC10.3 67.94,76.2 66.67,74.93 61.59,74.93 59.69,76.83 57.15,76.83 56.52,77.47 53.98,77.47 51.44,80.01 46.99,80.01 v45.72,78.74 | 93.98,74.93 95.25,73.66 IC7.4 100.33,73.66 101.6,74.93 107.95,74.93 109.22,76.2 IC8.3 | IC17.4 73.66,7.62 73.03,6.99 50.16,6.99 48.9,8.26 IC16.6 | v38.73,30.48 37.47,31.75 37.47,38.1 38.73,39.37 41.91,39.37 42.55,40.01 42.55,41.27 41.91,41.91 39.37,41.91 38.73,42.55 38.73,45.72 | v47.62,55.88 46.99,55.24 46.35,55.24 44.45,57.15 38.1,57.15 v37.47,56.52 | 38.73,45.72 IC9.3 | 38.73,45.72 v37.47,45.72 | 93.98,90.81 130.49,90.81 v131.44,91.76 | 93.98,74.93 v93.98,74.3 | v93.98,91.12 93.98,90.81 | v123.51,6.03 132.4,6.03 132.72,6.35 132.72,10.79 131.44,12.06 IC12.9
IN_A2  (via drill 0.6)
  Top 0.406: v52.7,5.08 52.7,13.34 51.44,14.61 IC16.10 51.44,19.05 52.07,19.68 52.07,45.09 v52.7,45.72 53.98,46.99 v53.98,62.23 | v65.41,62.87 v65.41,72.39 | v132.4,89.85 132.08,89.53 132.08,71.75 131.44,71.12 IC19.5
  Bottom 0.406: IC18.17 31.75,86.36 31.75,90.17 132.08,90.17 v132.4,89.85 | v52.7,45.72 IC9.14 | v52.7,5.08 53.34,5.71 76.83,5.71 78.74,7.62 IC17.6 78.74,11.11 79.06,11.43 126.05,11.43 126.36,11.11 IC12.4 | v53.98,62.23 64.77,62.23 v65.41,62.87 | v65.41,72.39 66.67,72.39 67.94,71.12 IC10.5 73.66,71.12 74.93,69.85 87,69.85 88.27,68.58 IC6.9 93.98,68.58 95.25,67.31 101.6,67.31 102.87,68.58 IC7.9 107.95,68.58 109.22,69.85 114.3,69.85 114.94,70.48 114.94,74.3 116.84,76.2 IC8.14 121.92,76.2 127,71.12 IC19.5
IN_A3  (via drill 0.6)
  Top 0.406: v114.94,77.47 114.94,71.75 115.57,71.12 IC8.12 123.19,71.12 123.83,70.48 v123.83,66.04 | v80.01,76.83 80.01,69.22 79.38,68.58 IC10.9 75.56,68.58 74.93,67.94 v74.93,56.83 | v46.35,56.52 46.35,50.16 46.99,49.53 49.53,49.53 50.16,48.9 50.16,47.62 49.53,46.99 46.99,46.99 46.35,46.35 46.35,41.27 46.67,40.96 | 46.67,40.96 46.99,40.64 IC9.12 | IC16.12 46.35,18.41 46.99,19.05 48.9,19.05 49.53,19.68 49.53,31.43 49.21,31.75 46.67,31.75 46.35,32.07 46.35,33.02 45.09,34.29 39.37,34.29 38.73,34.92 38.73,36.2 39.37,36.83 45.09,36.83 45.72,37.47 45.72,40.01 46.67,40.96 | v137.79,88.27 139.06,87 139.06,69.22 138.43,68.58 IC19.9 | IC12.1 118.75,13.34 v117.16,14.92
  Bottom 0.406: IC18.16 32.38,83.82 32.38,89.53 131.44,89.53 132.08,88.9 133.99,88.9 134.62,89.53 137.16,89.53 137.79,88.9 v137.79,88.27 | v114.94,77.47 108.58,77.47 107.31,76.2 IC7.12 101.6,76.2 100.33,74.93 95.25,74.93 93.98,76.2 IC6.12 87,76.2 85.72,77.47 80.64,77.47 v80.01,76.83 | 81.28,14.61 IC17.10 | 81.28,14.61 78.11,14.61 77.47,15.24 77.47,17.78 76.83,18.41 75.56,18.41 74.93,17.78 74.93,15.24 74.3,14.61 46.99,14.61 46.35,15.24 IC16.12 | v46.35,56.52 46.99,57.15 74.93,57.15 v74.93,56.83 | IC19.9 133.35,68.58 132.08,67.31 127.64,67.31 126.36,66.04 v123.83,66.04 | v117.16,14.92 116.84,14.61 81.28,14.61
IN_B0  (via drill 0.6)
  Top 0.406: IC18.15 IC11.1 | v101.6,66.04 101.6,78.11 100.97,78.74 IC7.2 | v135.25,88.27 136.53,89.53 137.79,89.53 139.7,87.63 139.7,73.98 v140.02,73.66 | IC12.13 121.28,20.32 117.79,23.81 117.47,66.67 v118.11,67.31
  Bottom 0.406: IC18.15 33.02,81.28 33.02,88.9 131.13,88.9 131.76,88.27 v135.25,88.27 | IC6.2 85.72,78.74 87,77.47 95.25,77.47 96.52,78.74 IC7.2 | v101.6,66.04 102.87,67.31 107.95,67.31 109.22,68.58 IC8.6 115.57,68.58 116.84,67.31 v118.11,67.31 125.73,67.31 128.27,69.85 130.81,69.85 134.62,73.66 IC19.11 v140.02,73.66
IN_B1  (via drill 0.6)
  Top 0.406: IC11.3 36.2,76.2 33.66,78.74 IC18.14 | v99.69,77.47 99.69,71.75 99.06,71.12 IC7.5 | v134.62,87 v134.62,81.92 134.62,79.38 135.25,78.74 IC19.13 | v124.78,80.01 124.78,79.06 127,76.83 127,54.93 126.68,54.61 126.68,48.58 126.36,48.26 126.36,41.91 126.05,41.59 126.05,34.61 128.91,31.75 IC12.10
  Bottom 0.406: IC18.14 33.66,78.74 33.66,88.27 130.81,88.27 131.44,87.63 133.99,87.63 v134.62,87 | IC7.5 96.52,71.12 95.25,72.39 87.63,72.39 86.36,71.12 IC6.5 | v99.69,77.47 107.31,77.47 108.58,78.74 IC8.2 114.94,78.74 116.2,80.01 v124.78,80.01 132.72,80.01 v134.62,81.92
IN_B2  (via drill 0.6)
  Top 0.406: IC11.5 38.73,71.12 33.66,76.2 IC18.13 | v126.36,78.74 127.64,77.47 127.64,57.15 128.27,56.52 IC20.1 131.13,56.52 131.44,56.2 131.44,47.94 131.13,47.62 127.95,47.62 127.64,47.31 127.64,45.4 127.95,45.09 131.13,45.09 131.44,44.77 131.44,27.62 130.18,26.35 130.18,11.11 128.91,9.84 IC12.5 | v88.9,86.36 88.9,71.75 89.53,71.12 IC6.10
  Bottom 0.406: IC18.13 32.38,76.2 34.29,78.11 34.29,87.63 87.63,87.63 v88.9,86.36 | IC6.10 93.98,71.12 95.25,69.85 100.97,69.85 102.23,71.12 IC7.10 106.05,71.12 109.86,74.93 113.67,74.93 117.47,78.74 IC8.15 v126.36,78.74
IN_B3  (via drill 0.6)
  Top 0.406: v87.63,86.36 v87.63,78.74 | v117.47,81.28 117.47,73.03 118.11,72.39 123.83,72.39 125.09,71.12 v125.09,69.22 v125.09,51.44 125.09,34.29 127.64,31.75 v127.64,12.38 | v121.28,12.38 IC12.2
  Bottom 0.406: IC18.12 31.11,73.66 | 31.11,73.66 34.92,77.47 34.92,87 87,87 v87.63,86.36 | IC11.9 46.35,68.58 42.55,72.39 32.38,72.39 31.11,73.66 | v87.63,78.74 IC6.13 93.98,78.74 95.25,80.01 100.33,80.01 101.6,78.74 IC7.13 107.31,78.74 108.58,80.01 114.94,80.01 116.2,81.28 v117.47,81.28 | v125.09,51.44 IC20.3 | v125.09,69.22 122.56,69.22 121.92,68.58 IC8.11 | v127.64,12.38 v121.28,12.38
LOAD_DATA  (via drill 0.6)
  Top 0.406: v15.24,36.2 v15.24,71.75
  Bottom 0.406: IC14.3 15.88,35.56 v15.24,36.2 | X1.10 11.43,74.93 14.61,71.75 v15.24,71.75 15.88,72.39 25.4,72.39 26.67,71.12 IC18.11
N$1
  Top 0.406: IC6.3 85.09,76.2 85.72,75.56 85.72,42.55 85.09,41.91 IC1.2
N$2
  Top 0.406: IC6.6 82.55,68.58 81.92,67.94 81.92,37.47 82.55,36.83 IC1.4
N$3
  Top 0.406: IC6.8 88.27,66.04 87.63,65.41 87.63,32.38 87,31.75 IC1.6
N$4
  Top 0.406: IC1.10 93.34,29.21 93.98,29.84 93.98,62.23 93.34,62.87 93.34,73.03 92.71,73.66 IC6.11
N$5
  Top 0.406: IC7.11 106.68,73.66 107.31,73.03 107.31,63.5 107.95,62.87 107.95,29.84 107.31,29.21 IC2.10
N$6
  Top 0.406: IC7.8 104.14,66.04 102.23,64.14 102.23,33.02 100.97,31.75 IC2.6
N$7
  Top 0.406: IC7.6 99.69,68.58 100.33,67.94 100.33,37.47 99.69,36.83 IC2.4
N$8
  Top 0.406: IC7.3 96.52,76.2 95.89,75.56 95.89,42.55 96.52,41.91 IC2.2
N$9  (via drill 0.6)
  Top 0.406: v141.6,80.01 141.6,87.63 143.51,89.53 LED1.K
  Bottom 0.406: IC19.2 132.72,78.74 133.99,80.01 v141.6,80.01
N$11
  Top 0.406: IC9.7 45.09,35.56 46.35,36.83 49.53,36.83 51.44,38.73 51.44,52.39 50.16,53.66 50.16,69.85 48.9,71.12 IC11.10
N$12
  Bottom 0.406: IC13.3 58.42,76.2 59.05,75.56 59.05,69.22 59.69,68.58 IC13.9
N$13
  Top 0.406: IC3.2 111.12,41.91 109.86,43.18 109.86,73.03 110.49,73.66 IC8.4
N$14
  Top 0.406: IC8.1 111.12,81.28 110.49,80.64 110.49,78.11 111.12,77.47 113.67,77.47 114.3,76.83 114.3,37.47 113.67,36.83 IC3.4
N$15  (via drill 0.6)
  Top 0.406: v116.84,69.22 116.84,33.66 114.94,31.75 IC3.6
  Bottom 0.406: IC8.13 121.28,73.66 121.92,73.03 121.92,70.48 121.28,69.85 117.47,69.85 v116.84,69.22
N$16
  Top 0.406: IC8.10 121.6,66.04 122.56,65.09 122.56,62.55 123.19,61.91 123.19,29.84 122.56,29.21 IC3.10
N$17
  Bottom 0.406: IC4.2 52.7,41.91 52.07,41.91 49.53,39.37 45.09,39.37 43.81,40.64 43.81,42.55 43.18,43.18 IC9.4
N$18  (via drill 0.6)
  Top 0.406: v38.73,37.47 38.73,50.16 39.37,50.8 IC9.1
  Bottom 0.406: IC4.4 39.37,36.83 v38.73,37.47
N$19  (via drill 0.6)
  Top 0.406: v53.34,31.75 v53.34,43.18
  Bottom 0.406: v53.34,31.75 IC4.6 | v53.34,43.18 IC9.13
N$20
  Bottom 0.406: IC4.10 60.33,29.21 59.05,27.94 47.62,27.94 46.35,29.21 46.35,34.92 46.99,35.56 IC9.10
N$21
  Bottom 0.406: IC9.9 59.69,33.02 60.96,34.29 IC4.12
N$22
  Top 0.406: IC3.12 121.92,34.29 122.56,34.92 122.56,61.59 121.92,62.23 121.92,62.87 121.28,63.5 IC8.9
N$23
  Bottom 0.406: LED2.K 143.51,82.55 142.88,81.92 142.88,75.56 142.24,74.93 133.35,74.93 132.08,73.66 IC19.4
N$24
  Bottom 0.406: IC19.6 130.81,68.58 134.62,72.39 142.88,72.39 146.05,75.56 LED3.K
N$25
  Bottom 0.406: IC13.10 64.14,71.12 64.77,70.48 64.77,67.94 64.14,67.31 59.69,67.31 58.42,68.58 IC13.6
N$26
  Bottom 0.406: IC11.13 51.44,78.74 53.34,76.83 53.34,67.31 58.42,67.31 59.69,66.04 IC13.8
N$27
  Bottom 0.406: IC19.8 140.97,66.04 143.51,68.58 LED4.K
N$28
  Bottom 0.406: IC19.10 138.43,71.12 139.06,70.48 139.06,67.94 138.43,67.31 135.89,67.31 135.25,66.67 135.25,64.14 137.79,61.59 LED5.K
N$29
  Top 0.406: IC11.2 43.18,78.74 43.81,78.11 43.81,38.73 43.18,38.1 IC9.6
N$30
  Top 0.406: IC9.2 41.91,48.26 42.55,48.9 42.55,73.03 41.91,73.66 IC11.4
N$31  (via drill 0.6)
  Top 0.406: v44.77,67.94 44.45,67.63 44.45,49.53 45.72,48.26 IC9.15
  Bottom 0.406: IC11.6 44.13,68.58 v44.77,67.94
N$32
  Top 0.406: IC9.11 49.53,38.1 50.8,39.37 50.8,52.07 49.53,53.34 49.53,64.77 IC11.8
N$33
  Top 0.406: IC10.2 71.12,78.74 71.75,78.11 71.75,42.55 71.12,41.91 IC5.2
N$34
  Top 0.406: IC5.4 70.48,36.83 72.39,38.73 72.39,78.74 71.12,80.01 68.58,80.01 67.94,79.38 67.94,74.3 68.58,73.66 IC10.4
N$35
  Top 0.406: IC5.6 69.22,31.75 67.94,33.02 67.94,67.94 68.58,68.58 IC10.6
N$36
  Top 0.406: IC5.10 78.74,29.21 80.01,30.48 80.01,65.41 79.38,66.04 IC10.8
N$37  (via drill 0.6)
  Top 0.406: v141.6,60.64 v141.6,76.2
  Bottom 0.406: v141.6,60.64 141.6,55.24 142.24,54.61 LED6.K | v141.6,76.2 IC19.12
N$38
  Bottom 0.406: LED7.K 133.99,47.62 132.72,48.9 132.72,53.34 132.08,53.98 IC20.2
N$39
  Bottom 0.406: IC20.4 130.81,48.9 134.62,45.09 143.51,45.09 LED8.K
N$40
  Bottom 0.406: LED1.A R1.1
N$41
  Bottom 0.406: LED2.A R3.1
N$43
  Bottom 0.406: LED3.A R4.1
N$44
  Bottom 0.406: LED4.A R5.1
N$45
  Bottom 0.406: LED5.A R6.1
N$46
  Bottom 0.406: LED6.A R7.1
N$47
  Bottom 0.406: LED7.A R8.1
N$48
  Bottom 0.406: LED8.A R9.1
N$49  (via drill 0.6)
  Top 0.406: v144.78,51.44 144.78,33.66 146.69,31.75 LED9.K
  Bottom 0.406: v144.78,51.44 IC20.12
N$50  (via drill 0.6)
  Top 0.406: v143.51,46.35 144.15,45.72 144.15,25.72 145.1,24.77 LED10.K
  Bottom 0.406: v143.51,46.35 IC20.10
N$51  (via drill 0.6)
  Top 0.406: v143.19,40.96 143.51,40.64 143.51,19.05 144.78,17.78 LED11.K
  Bottom 0.406: IC20.8 142.88,41.27 v143.19,40.96
N$52  (via drill 0.6)
  Top 0.406: v142.24,42.55 142.24,40.32 142.88,39.69 142.88,12.38 144.46,10.79 LED12.K
  Bottom 0.406: IC20.6 132.08,43.81 133.35,42.55 v142.24,42.55
N$53
  Bottom 0.406: LED9.A R2.1
N$54
  Bottom 0.406: LED10.A R10.1
N$55
  Bottom 0.406: LED11.A R11.1
N$56
  Bottom 0.406: LED12.A R12.1
N$63  (via drill 0.6)
  Top 0.406: IC21.2 94.61,13.34 v94.93,13.65
  Bottom 0.406: v94.93,13.65 95.25,13.97 121.6,13.97 121.92,14.29 126.05,14.29 126.36,14.61 IC12.11
N$64  (via drill 0.6)
  Top 0.406: IC12.8 133.99,12.38 135.25,11.11 135.25,7.3 134.94,6.99 126.68,6.99 124.14,4.45 100.01,4.45 v99.69,4.13
  Bottom 0.406: v99.69,4.13 IC21.4
N$65
  Bottom 0.406: IC12.6 131.44,7.3 131.13,6.99 105.09,6.99 104.78,7.3 IC21.6
N$66  (via drill 0.6)
  Top 0.406: v106.05,10.48 106.05,12.06 107.31,13.34 IC21.10
  Bottom 0.406: IC12.3 123.83,10.16 123.19,10.79 106.36,10.79 v106.05,10.48
OUT_0  (via drill 0.6)
  Top 0.406: IC13.1 57.78,81.28 58.42,80.64 58.42,40.01 57.78,39.37 IC4.3 59.05,39.37 60.33,38.1 v60.33,12.06 v60.33,3.17 | IC16.3 41.27,10.79 40.01,12.06 v34.92,12.06 | v8.26,12.7 8.26,33.66 7.62,34.29 7.62,43.81 6.35,45.09 X2.1 | v127,41.27 127,47.94 127.32,48.26 127.32,54.29 v128.27,55.24 | IC21.3 97.16,6.67 96.84,6.35 76.52,6.35 76.2,6.67 IC17.5
  Bottom 0.406: IC4.3 59.05,39.37 60.33,40.64 66.04,40.64 67.31,39.37 IC5.3 73.03,39.37 74.3,40.64 80.01,40.64 81.28,39.37 IC1.3 87,39.37 88.27,40.64 94.61,40.64 95.89,39.37 IC2.3 100.97,39.37 102.23,40.64 107.95,40.64 109.22,39.37 IC3.3 115.57,39.37 116.84,40.64 126.36,40.64 v127,41.27 | v60.33,3.17 43.18,3.17 41.27,5.08 IC16.3 | v34.92,12.06 8.89,12.06 v8.26,12.7 | v128.27,55.24 133.03,55.24 134.3,53.98 IC20.13 | IC17.5 76.2,10.48 74.61,12.06 v60.33,12.06
OUT_1  (via drill 0.6)
  Top 0.406: 46.35,10.79 IC16.5 | 46.35,10.79 50.16,14.61 v50.16,34.29 | v66.99,34.61 v66.99,77.47 | IC17.7 81.28,12.06 v81.6,12.38 82.55,13.34 82.55,24.77 81.28,26.04 81.28,33.66 81.92,34.29 IC1.5 | 46.35,10.79 45.09,12.06 v45.09,20.32 | v14.29,20.64 13.97,20.95 13.97,33.02 11.11,35.88 11.11,43.5 X2.2 | v134.94,38.1 134.94,48.26 135.57,48.9 IC20.11 | v102.23,12.38 IC21.5
  Bottom 0.406: v50.16,34.29 IC4.5 59.05,34.29 60.33,35.56 66.04,35.56 v66.99,34.61 67.31,34.29 IC5.5 73.03,34.29 74.3,35.56 80.64,35.56 81.92,34.29 IC1.5 87,34.29 88.27,35.56 94.61,35.56 95.89,34.29 IC2.5 100.97,34.29 102.23,35.56 108.58,35.56 109.86,34.29 IC3.5 113.98,34.29 117.79,38.1 v134.94,38.1 | IC13.2 57.15,78.74 58.42,77.47 v66.99,77.47 | v45.09,20.32 43.81,21.59 18.41,21.59 17.14,20.32 14.61,20.32 v14.29,20.64 | v102.23,12.38 101.92,12.06 81.92,12.06 v81.6,12.38
OUT_2  (via drill 0.6)
  Top 0.406: IC17.9 84.45,16.51 85.72,17.78 85.72,28.57 85.09,29.21 IC1.7 | IC13.4 57.15,73.66 57.78,73.03 57.78,41.27 57.15,40.64 54.61,40.64 53.98,40.01 53.98,38.73 54.61,38.1 57.78,38.1 58.42,37.47 58.42,29.84 57.78,29.21 | 57.78,29.21 IC4.7 | v57.78,10.79 57.78,29.21 | IC16.7 51.44,5.71 50.16,4.45 13.34,4.45 11.43,6.35 11.43,34.29 10.16,35.56 v10.16,41.91 | v139.06,33.02 139.06,43.5 138.75,43.81 IC20.9 | IC21.7 107.31,12.06 108.58,13.34 108.58,27.94 v109.86,29.21
  Bottom 0.406: IC4.7 59.05,29.21 60.33,30.48 66.04,30.48 67.31,29.21 IC5.7 73.03,29.21 74.3,30.48 80.01,30.48 81.28,29.21 IC1.7 87,29.21 88.27,30.48 94.61,30.48 95.89,29.21 IC2.7 101.6,29.21 102.87,30.48 108.58,30.48 v109.86,29.21 IC3.7 114.62,29.21 118.43,33.02 v139.06,33.02 | IC16.7 51.44,10.79 v57.78,10.79 | X2.3 6.99,43.18 8.26,41.91 v10.16,41.91
OUT_3  (via drill 0.6)
  Top 0.406: IC17.11 78.74,25.4 IC5.9 | v62.87,16.51 62.55,16.83 62.55,25.72 IC4.9 | IC13.5 53.34,71.12 52.7,70.48 v52.7,55.88 | v103.5,55.24 103.5,27.3 104.14,26.67 IC2.9 | IC16.9 54.61,16.51 56.52,14.61 56.52,3.81 55.88,3.17 12.7,3.17 4.45,11.43 4.45,46.67 4.76,46.99 7.3,46.99 7.62,46.67 7.62,45.09 8.89,43.81 X2.4 | v132.08,26.67 132.08,45.72 131.44,46.35 IC20.5 | IC21.9 109.86,27.3 v110.49,27.94
  Bottom 0.406: IC4.9 66.04,26.67 67.31,27.94 73.03,27.94 74.3,26.67 IC5.9 80.01,26.67 81.28,27.94 87,27.94 88.27,26.67 IC1.9 93.98,26.67 95.25,27.94 101.6,27.94 102.87,26.67 IC2.9 107.95,26.67 109.22,27.94 v110.49,27.94 116.2,27.94 117.47,26.67 IC3.9 v132.08,26.67 | v103.5,55.24 75.25,55.24 73.98,56.52 53.34,56.52 v52.7,55.88 | IC16.9 v62.87,16.51
VCC  (via drill 0.6)
  Top 1.016: 137.16,59.05 137.16,59.69 | IC17.16 66.04,32.7 65.72,33.02 65.72,43.5 64.77,44.45 IC4.16
  Top 1.422: R1.2 R3.2 R4.2 R5.2 R6.2 156.84,59.05 | 156.84,59.05 R7.2 R8.2 R9.2 R2.2 R10.2 R11.2 R12.2 | IC11.14 48.26,93.98 IC18.20 27.94,93.98 26.04,92.08 26.04,69.85 C2.1 29.21,66.67 IC15.16 31.75,64.77 v31.75,52.7 31.75,43.81 29.21,43.81 | 29.21,43.81 C6.1 | 29.21,43.81 IC14.14 31.75,40.64 32.38,40.01 32.38,16.51 C1.1 | C5.1 63.5,80.64 IC13.14 | IC20.14 137.16,59.05 156.84,59.05 | 137.16,59.69 C11.1
  Bottom 0.406: IC14.10 27.94,30.48 25.4,33.02 | 25.4,33.02 IC14.4 | 25.4,33.02 25.4,38.1 IC14.13 IC14.14 IC14.1
  Bottom 1.016: IC9.16 47.62,50.8 | 96.2,83.82 95.89,84.14 | IC17.16 66.04,19.37 92.08,19.37 | 92.08,19.37 IC21.16 | IC12.14 115.89,19.37 104.46,19.37 | 92.08,19.37 104.46,19.37 | 104.46,19.37 C13.1
  Bottom 1.422: IC11.14 50.8,83.82 62.87,83.82 | 62.87,83.82 IC13.14 | 62.87,83.82 77.47,83.82 | 77.47,83.82 IC10.14 | 91.44,83.82 IC6.14 | 77.47,83.82 91.44,83.82 | 105.41,83.82 IC7.14 | 120.02,83.82 IC8.16 | 105.41,83.82 120.02,83.82 | IC18.20 C4.1 | IC3.16 116.2,48.26 C3.1 | C3.1 IC2.16 | 91.44,48.26 C3.1 | 91.44,48.26 IC1.16 | C9.1 91.44,48.26 | C9.1 IC5.16 | C10.1 C9.1 | C10.1 IC4.16 | C10.1 60.96,50.8 IC9.16 46.35,52.7 v31.75,52.7 | 120.02,83.82 C8.1 | C1.1 32.07,16.19 32.38,16.51 IC16.16 | 91.44,83.82 96.2,83.82 105.41,83.82 | 137.16,83.82 IC19.14 | 120.02,83.82 137.16,83.82 | X1.15 X1.16 19.37,67.31 21.59,66.36 27.62,66.36 IC15.16 C12.+ | 95.89,84.14 C7.1 | 137.16,83.82 138.75,85.41 156.84,85.41 R3.2
ZERO_OUT  (via drill 0.6)
  Top 0.406: v13.97,82.55 12.7,81.28 2.86,81.28 v2.86,41.91 | v31.75,82.55 v44.45,82.55
  Bottom 0.406: IC11.12 46.99,76.2 44.45,78.74 v44.45,82.55 | v2.86,41.91 6.99,41.91 8.26,40.64 X2.6 | v13.97,82.55 v31.75,82.55

### Text on the board
tNames: 4BC ALU (c) 2018 SP | A0 | A1 | A2 | A3 | NOT | AND | OR | B0 | ADD | input | B1 | B2 | B3 | OUT0 | output | SUB | OUT1 | OUT2 | OUT3 | SHR | SHL | XOR | C:/Users/svpet/Pictures/ham_black_mono.bmp | C:/Users/svpet/Pictures/ham_black_mono.bmp